# Altium project SLT.PrjPcb (part 2 of 3)

## Sheet USB.SchDoc
size 420 x 297 mm; SheetNumber: 12; SheetTotal: 19
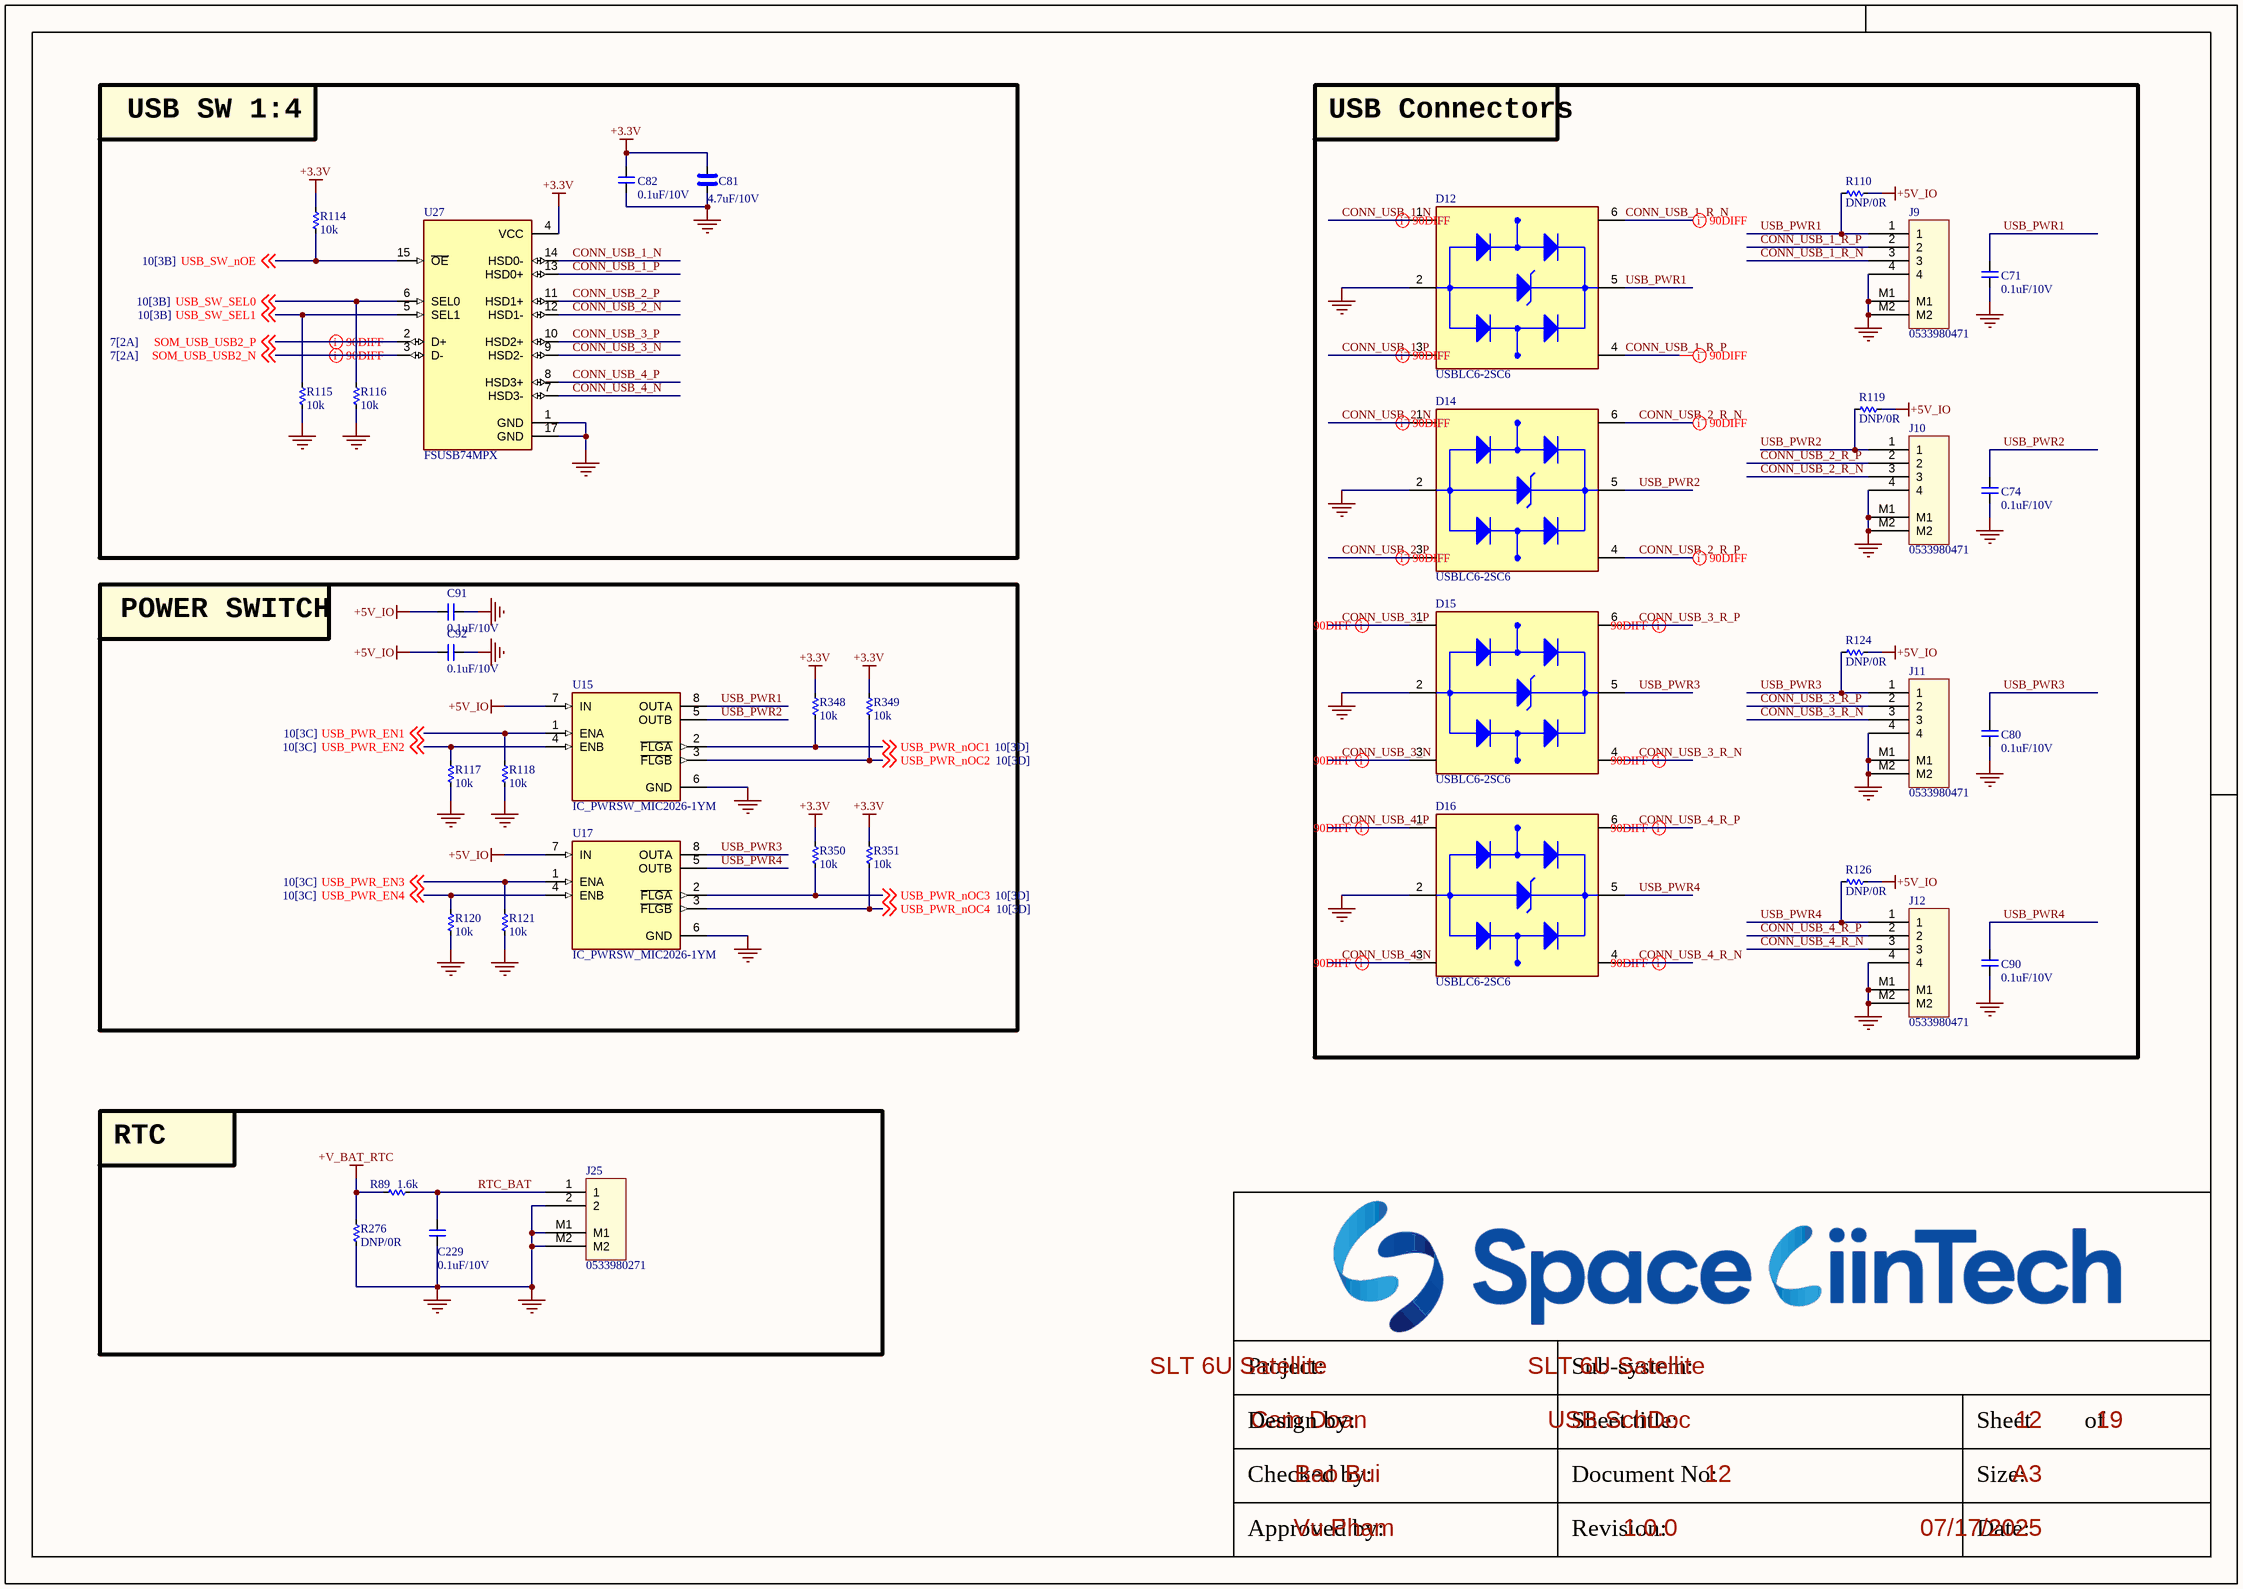
[diagram p18: USB.SchDoc]

### Parts
C71  0.1uF/10V  [CAP_C_1005X60]
C74  0.1uF/10V  [CAP_C_1005X60]
C80  0.1uF/10V  [CAP_C_1005X60]
C81  4.7uF/10V  [CAP_C_1608X80]
C82  0.1uF/10V  [CAP_C_1005X60]
C90  0.1uF/10V  [CAP_C_1005X60]
C91  0.1uF/10V  [CAP_C_1005X60]
C92  0.1uF/10V  [CAP_C_1005X60]
C229  0.1uF/10V  [CAP_C_1005X60]
D12  USBLC6-2SC6  [SOT95P280X145-6N]
D14  USBLC6-2SC6  [SOT95P280X145-6N]
D15  USBLC6-2SC6  [SOT95P280X145-6N]
D16  USBLC6-2SC6  [SOT95P280X145-6N]
J9  0533980471  [MOLEX_0533980471]
J10  0533980471  [MOLEX_0533980471]
J11  0533980471  [MOLEX_0533980471]
J12  0533980471  [MOLEX_0533980471]
J25  0533980271  [MOLEX_0533980271]
R89  1.6k  [RES_C_1005X40]
R110  DNP/0R  [RES_C_1005X40]
R114  10k  [RES_C_1005X40]
R115  10k  [RES_C_1005X40]
R116  10k  [RES_C_1005X40]
R117  10k  [RES_C_1005X40]
R118  10k  [RES_C_1005X40]
R119  DNP/0R  [RES_C_1005X40]
R120  10k  [RES_C_1005X40]
R121  10k  [RES_C_1005X40]
R124  DNP/0R  [RES_C_1005X40]
R126  DNP/0R  [RES_C_1005X40]
R276  DNP/0R  [RES_C_1005X40]
R348  10k  [RES_C_1005X40]
R349  10k  [RES_C_1005X40]
R350  10k  [RES_C_1005X40]
R351  10k  [RES_C_1005X40]
U15  IC_PWRSW_MIC2026-1YM  [SOIC127P602X173-8N]
U17  IC_PWRSW_MIC2026-1YM  [SOIC127P602X173-8N]
U27  FSUSB74MPX  [QFN50P300X300X80-17N]

### Blocks framed on the sheet
USB SW 1:4: C81 C82 R114-R116 U27
USB Connectors: C71 C74 C80 C90 D12 D14-D16 J9-J12 R110 R119 R124 R126
POWER SWITCH: C91 C92 R117 R118 R120 R121 R348-R351 U15 U17
RTC: C229 J25 R89 R276

### Nets
+3.3V: C81.2 C82.2 R114.1 R348.1 R349.1 R350.1 R351.1 U27.4(VCC)
+5V_IO: C91.2 C92.2 R110.1 R119.1 R124.1 R126.1 U15.7(IN) U17.7(IN)  [project net NTC1+]
+V_BAT_RTC: R89.1 R276.1
GND: C71.1 C74.1 C80.1 C81.1 C82.1 C90.1 C91.1 C92.1 C229.1 D12.2(GND) D14.2(GND) D15.2(GND) D16.2(GND) J9.4 J9.M1 J9.M2 J10.4 J10.M1 J10.M2 J11.4 J11.M1 J11.M2 J12.4 J12.M1 J12.M2 J25.2 J25.M1 J25.M2 R115.2 R116.2 R117.2 R118.2 R120.2 R121.2 R276.2 U15.6(GND) U17.6(GND) U27.1(GND) U27.17(GND)
CONN_USB_1_N: D12.1(I/O1_IN) U27.14(HSD0-)
CONN_USB_1_P: D12.3(I/O2_IN) U27.13(HSD0+)
CONN_USB_1_R_N: D12.6(I/O1_OUT) J9.3
CONN_USB_1_R_P: D12.4(I/O2_OUT) J9.2
CONN_USB_2_N: D14.1(I/O1_IN) U27.12(HSD1-)
CONN_USB_2_P: D14.3(I/O2_IN) U27.11(HSD1+)
CONN_USB_2_R_N: D14.6(I/O1_OUT) J10.3
CONN_USB_2_R_P: D14.4(I/O2_OUT) J10.2
CONN_USB_3_N: D15.3(I/O2_IN) U27.9(HSD2-)
CONN_USB_3_P: D15.1(I/O1_IN) U27.10(HSD2+)
CONN_USB_3_R_N: D15.4(I/O2_OUT) J11.3
CONN_USB_3_R_P: D15.6(I/O1_OUT) J11.2
CONN_USB_4_N: D16.3(I/O2_IN) U27.7(HSD3-)
CONN_USB_4_P: D16.1(I/O1_IN) U27.8(HSD3+)
CONN_USB_4_R_N: D16.4(I/O2_OUT) J12.3
CONN_USB_4_R_P: D16.6(I/O1_OUT) J12.2
RTC_BAT: C229.2 J25.1 R89.2
SOM_USB_USB2_N: U27.3(D-) ; off-sheet SOM_USB_USB2_N
SOM_USB_USB2_P: U27.2(D+) ; off-sheet SOM_USB_USB2_P
USB_PWR1: C71.2 D12.5(VBUS) J9.1 R110.2 U15.8(OUTA)
USB_PWR2: C74.2 D14.5(VBUS) J10.1 R119.2 U15.5(OUTB)
USB_PWR3: C80.2 D15.5(VBUS) J11.1 R124.2 U17.8(OUTA)
USB_PWR4: C90.2 D16.5(VBUS) J12.1 R126.2 U17.5(OUTB)
USB_PWR_EN1: R118.1 U15.1(ENA) ; off-sheet USB_PWR_EN1
USB_PWR_EN2: R117.1 U15.4(ENB) ; off-sheet USB_PWR_EN2
USB_PWR_EN3: R121.1 U17.1(ENA) ; off-sheet USB_PWR_EN3
USB_PWR_EN4: R120.1 U17.4(ENB) ; off-sheet USB_PWR_EN4
USB_PWR_nOC1: R348.2 U15.2(~{FLGA}) ; off-sheet USB_PWR_nOC1
USB_PWR_nOC2: R349.2 U15.3(~{FLGB}) ; off-sheet USB_PWR_nOC2
USB_PWR_nOC3: R350.2 U17.2(~{FLGA}) ; off-sheet USB_PWR_nOC3
USB_PWR_nOC4: R351.2 U17.3(~{FLGB}) ; off-sheet USB_PWR_nOC4
USB_SW_nOE: R114.2 U27.15(~{OE}) ; off-sheet USB_SW_nOE
USB_SW_SEL0: R116.1 U27.6(SEL0) ; off-sheet USB_SW_SEL0
USB_SW_SEL1: R115.1 U27.5(SEL1) ; off-sheet USB_SW_SEL1

### Layout directives
differential pair; differential pair class DIFF90: CONN_USB_1_N, CONN_USB_1_P, CONN_USB_1_R_N, CONN_USB_1_R_P, CONN_USB_2_N, CONN_USB_2_P, CONN_USB_2_R_N, CONN_USB_2_R_P, CONN_USB_3_N, CONN_USB_3_P, CONN_USB_3_R_N, CONN_USB_3_R_P, CONN_USB_4_N, CONN_USB_4_P, CONN_USB_4_R_N, CONN_USB_4_R_P, SOM_USB_USB2_N, SOM_USB_USB2_P

### Notes on the sheet
- Project:
- Sub-system:
- Design by:
- Sheet title:
- Sheet
- of
- Checked by:
- Approved by:
- Revision:
- Document No:
- Size:
- Date:
- A3

### Library data of the parts
C71 C74 C80 C82 C90-C92 C229 = _CAP_C_2: CAP CHIP
C81 = _CAP_C_High_2: CAP CHIP High Value
D12 D14-D16 = USBLC6-2SC6: 17V Clamp 5A (8/20Âµs) Ipp Tvs Diode Surface Mount SOT-23-6; MF: STMicroelectronics; Value: *; SnapEDA_Link: https://www.snapeda.com/parts/USBLC6-2SC6/STMicroelectronics/view-part/?ref=snap; Check_prices: https://www.snapeda.com/parts/USBLC6-2SC6/STMicroelectronics/view-part/?ref=eda; Purchase-URL: https://pricing.snapeda.com/search/part/USBLC6-2SC6/?ref=eda; Price: None; Availability: In Stock; Package: SOT-23-6 STMicroelectronics; MP: USBLC6-2SC6
J9-J12 = Header 4x1_2M
J25 = Header 2x1_2M
R89 R110 R114-R121 R124 R126 R276 R348-R351 = _RES_B_2: RES
U15 U17 = IC_PWRSW_MIC2026-1YM: Power Switch/Driver 1:2 N-Channel 1.25A 8-SOIC; MF: Microchip; SnapEDA_Link: https://www.snapeda.com/parts/MIC2026-1YM/Microchip/view-part/?ref=snap; Package: SO-8 Microchip; Value: *; MP: MIC2026-1YM; Check_prices: https://www.snapeda.com/parts/MIC2026-1YM/Microchip/view-part/?ref=eda
U27 = IC_USB_SW_FSUSB74MPX: USB Switch IC 1 Channel 16-MLP (3x3); MF: ON Semiconductor; SnapEDA_Link: https://www.snapeda.com/parts/FSUSB74MPX/Onsemi/view-part/?ref=snap; Package: WQFN-16 ON Semiconductor; Value: *; MP: FSUSB74MPX; Check_prices: https://www.snapeda.com/parts/FSUSB74MPX/Onsemi/view-part/?ref=eda

## Sheet LED.SchDoc
size 420 x 297 mm; SheetNumber: 13; SheetTotal: 19
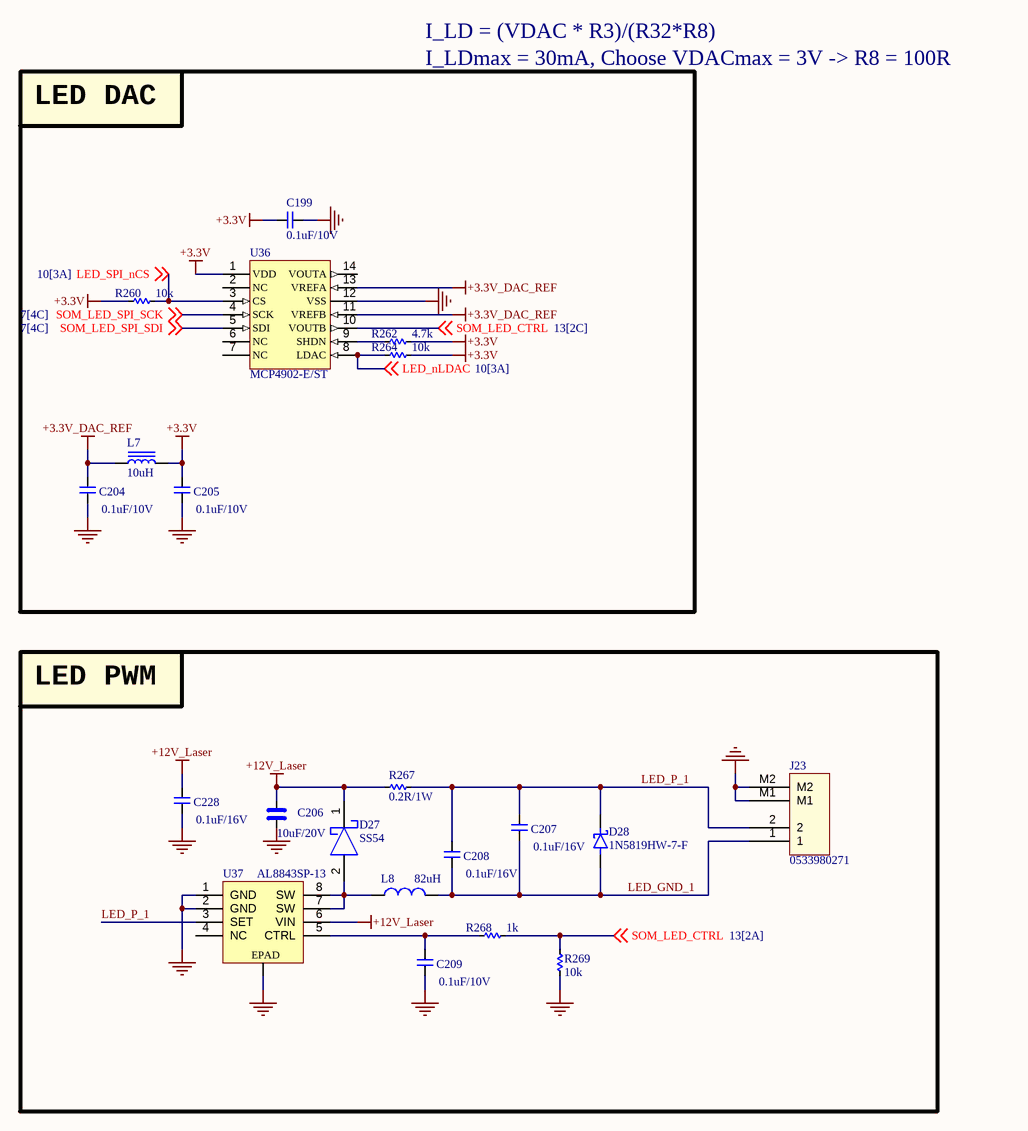
[diagram p19: LED.SchDoc]

### Parts
C199  0.1uF/10V  [CAP_C_1005X60]
C204  0.1uF/10V  [CAP_C_1005X60]
C205  0.1uF/10V  [CAP_C_1005X60]
C206  10uF/20V  [CAP_C_2012X110]
C207  0.1uF/16V  [CAP_C_1005X60]
C208  0.1uF/16V  [CAP_C_1005X60]
C209  0.1uF/10V  [CAP_C_1005X60]
C228  0.1uF/16V  [CAP_C_1005X60]
D27  SS54  [DO-214AC_SMA]
D28  1N5819HW-7-F  [SOD3717X145N]
J23  0533980271  [MOLEX_0533980271]
L7  10uH  [IND_C_2012X65]
L8  82uH  [L-SMD-M-4.8x4.8x2.8mm]
R260  10k  [RES_C_1005X40]
R262  4.7k  [RES_C_1005X40]
R264  10k  [RES_C_1005X40]
R267  0.2R/1W  [RES_C_3216X70]
R268  1k  [RES_C_1005X40]
R269  10k  [RES_C_1005X40]
U36  MCP4902-E/ST  [SOIC127P600X175-14N]
U37  AL8843SP-13  [SOIC127P602X173-8N_EPAD]

### Blocks framed on the sheet
LED DAC: C199 C204 C205 L7 R260 R262 R264 U36
LED PWM: C206-C209 C228 D27 D28 J23 L8 R267-R269 U37

### Nets
+3.3V: C199.2 C205.2 L7.2 R260.1 R262.2 R264.2 U36.1(VDD)
+3.3V_DAC_REF: C204.2 L7.1 U36.11(VREFB) U36.13(VREFA)
+12V_Laser: C206.1 C228.2 D27.1 R267.2 U37.6(VIN)
GND: C199.1 C204.1 C205.1 C206.2 C209.1 C228.1 J23.M1 J23.M2 R269.1 U36.12(VSS) U37.1(GND) U37.2(GND) U37.EPAD
LED_GND_1: C207.1 C208.1 D28.2(A) J23.1 L8.2
LED_nLDAC: R264.1 U36.8(LDAC) ; off-sheet LED_nLDAC
LED_P_1: C207.2 C208.2 D28.1(K) J23.2 R267.1 U37.3(SET)
LED_SPI_nCS: R260.2 U36.3(CS) ; off-sheet LED_SPI_nCS
SOM_LED_CTRL: R268.2 R269.2 U36.10(VOUTB) ; off-sheet SOM_LED_CTRL
SOM_LED_SPI_SCK: U36.4(SCK) ; off-sheet SOM_LED_SPI_SCK  [project net SPI1_SCK]
SOM_LED_SPI_SDI: U36.5(SDI) ; off-sheet SOM_LED_SPI_SDI  [project net SPI1_MOSI]
NetC209_2: C209.2 R268.1 U37.5(CTRL)
NetD27_2: D27.2 L8.1 U37.7(SW) U37.8(SW)
NetR262_1: R262.1 U36.9(SHDN)

Not connected (* = marked no-connect by the designer): U36 2(NC) 6(NC) 7(NC) 14(VOUTA); U37 4(NC)

### Notes on the sheet
- I_LD = (VDAC * R3)/(R32*R8)
- I_LDmax = 30mA, Choose VDACmax = 3V -> R8 = 100R
- Project:
- Sub-system:
- Design by:
- Sheet title:
- Sheet
- of
- Checked by:
- Approved by:
- Revision:
- Document No:
- Size:
- Date:
- A3

### Library data of the parts
C199 C204 C205 C207-C209 C228 = _CAP_C_2: CAP CHIP
C206 = _CAP_C_High_2: CAP CHIP High Value
D27 = SS54: DIODE SCHOTTKY 60V 3A DO214AA
D28 = DIODE SCHOTTKY: DIODE SCHOTTKY 40V 1A SOD123
J23 = Header 2x1_2M
L7 = Inductor: MLZ1608N100LT000; Value: 1.5uH
L8 = L-SMD-1: SRR4828A-820M; partNo: 78477010; Manufacturer: Wurth Elektronik; Inductance: 1.0 μH; ComponentLink1Description: Manufacturer; ComponentLink1URL: http://www.we-online.de; Created by: Baojun Chen; Created Date: Nov.2015; ComponentLink2Description: Datasheet; ComponentLink2URL: http://katalog.we-online.de/pbs/datasheet/78477010.pdf
R260 R262 R264 R267-R269 = _RES_B_2: RES
U36 = MCP4902: IC DAC 8BIT V-OUT 14TSSOP
U37 = AL8843SP-13: IC LED DRIVER RGLTR PWM 3A 8SO

## Sheet TEC.SchDoc
size 420 x 297 mm; SheetNumber: 14; SheetTotal: 19
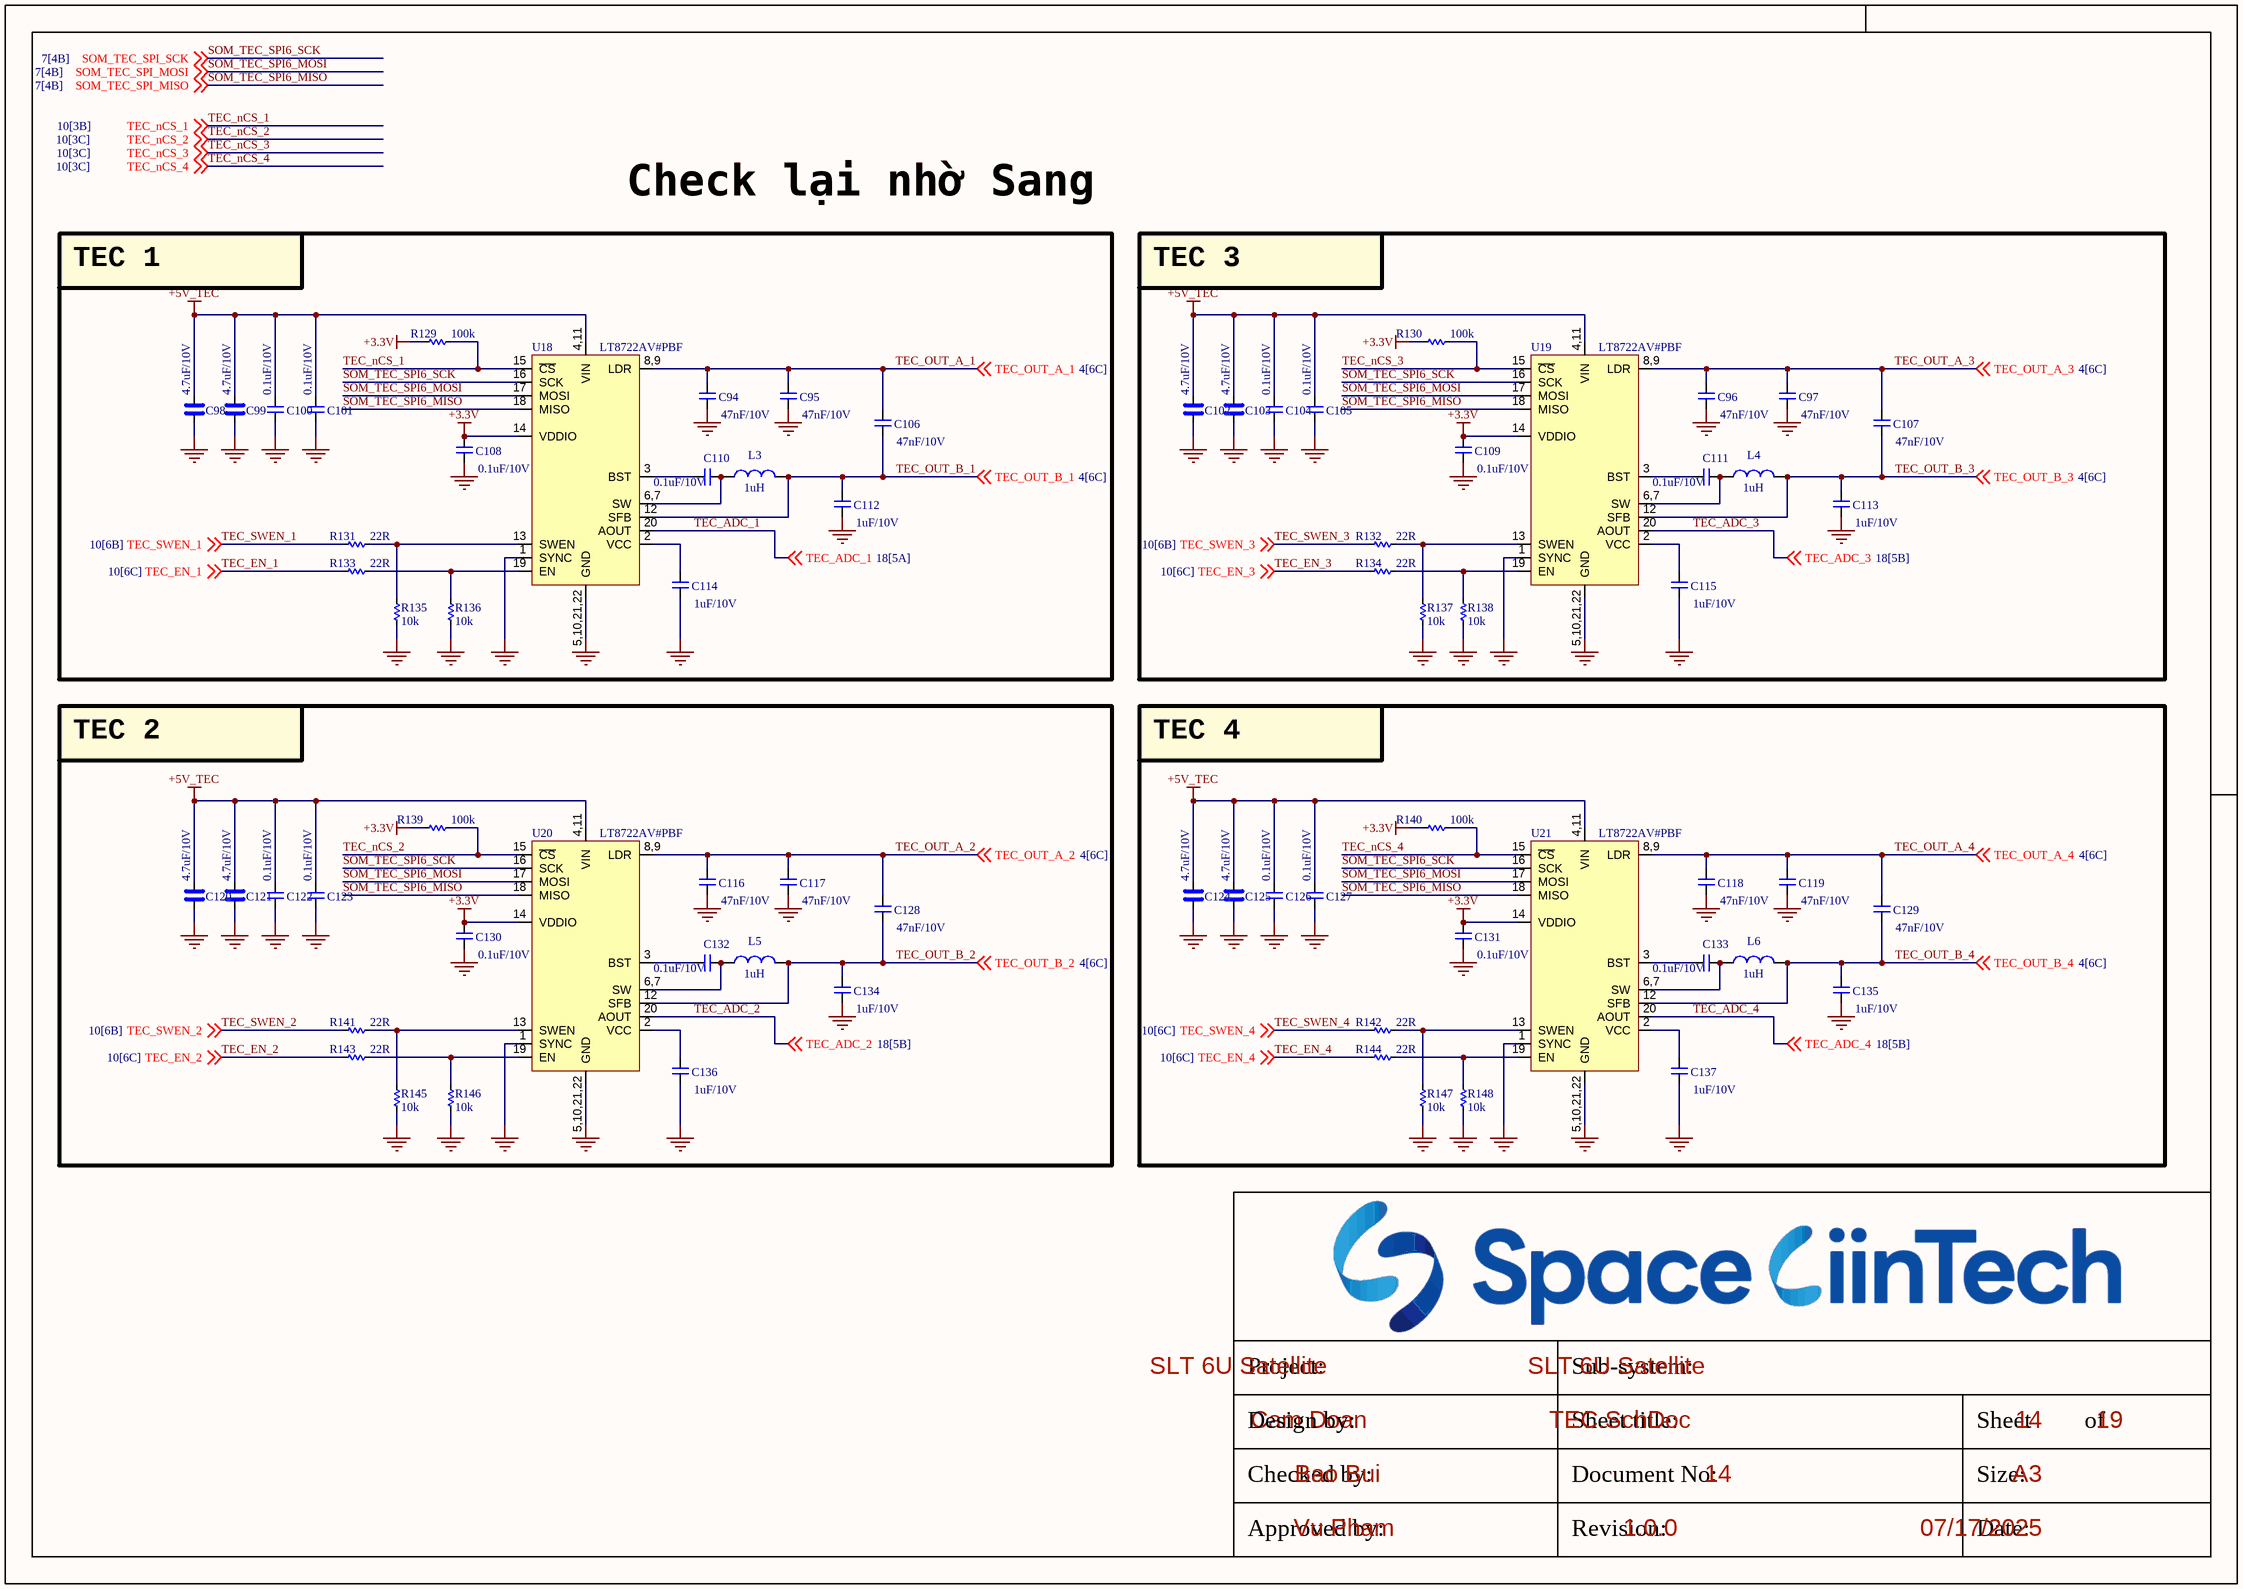
[diagram p20: TEC.SchDoc]

### Parts
C94  47nF/10V  [CAP_C_1005X60]
C95  47nF/10V  [CAP_C_1005X60]
C96  47nF/10V  [CAP_C_1005X60]
C97  47nF/10V  [CAP_C_1005X60]
C98  4.7uF/10V  [CAP_C_1608X80]
C99  4.7uF/10V  [CAP_C_1608X80]
C100  0.1uF/10V  [CAP_C_1005X60]
C101  0.1uF/10V  [CAP_C_1005X60]
C102  4.7uF/10V  [CAP_C_1608X80]
C103  4.7uF/10V  [CAP_C_1608X80]
C104  0.1uF/10V  [CAP_C_1005X60]
C105  0.1uF/10V  [CAP_C_1005X60]
C106  47nF/10V  [CAP_C_1005X60]
C107  47nF/10V  [CAP_C_1005X60]
C108  0.1uF/10V  [CAP_C_1005X60]
C109  0.1uF/10V  [CAP_C_1005X60]
C110  0.1uF/10V  [CAP_C_1005X60]
C111  0.1uF/10V  [CAP_C_1005X60]
C112  1uF/10V  [CAP_C_1005X60]
C113  1uF/10V  [CAP_C_1005X60]
C114  1uF/10V  [CAP_C_1005X60]
C115  1uF/10V  [CAP_C_1005X60]
C116  47nF/10V  [CAP_C_1005X60]
C117  47nF/10V  [CAP_C_1005X60]
C118  47nF/10V  [CAP_C_1005X60]
C119  47nF/10V  [CAP_C_1005X60]
C120  4.7uF/10V  [CAP_C_1608X80]
C121  4.7uF/10V  [CAP_C_1608X80]
C122  0.1uF/10V  [CAP_C_1005X60]
C123  0.1uF/10V  [CAP_C_1005X60]
C124  4.7uF/10V  [CAP_C_1608X80]
C125  4.7uF/10V  [CAP_C_1608X80]
C126  0.1uF/10V  [CAP_C_1005X60]
C127  0.1uF/10V  [CAP_C_1005X60]
C128  47nF/10V  [CAP_C_1005X60]
C129  47nF/10V  [CAP_C_1005X60]
C130  0.1uF/10V  [CAP_C_1005X60]
C131  0.1uF/10V  [CAP_C_1005X60]
C132  0.1uF/10V  [CAP_C_1005X60]
C133  0.1uF/10V  [CAP_C_1005X60]
C134  1uF/10V  [CAP_C_1005X60]
C135  1uF/10V  [CAP_C_1005X60]
C136  1uF/10V  [CAP_C_1005X60]
C137  1uF/10V  [CAP_C_1005X60]
L3  1uH  [L-SMD-M-3.5x3.5x2mm]
L4  1uH  [L-SMD-M-3.5x3.5x2mm]
L5  1uH  [L-SMD-M-3.5x3.5x2mm]
L6  1uH  [L-SMD-M-3.5x3.5x2mm]
R129  100k  [RES_C_1005X40]
R130  100k  [RES_C_1005X40]
R131  22R  [RES_C_1005X40]
R132  22R  [RES_C_1005X40]
R133  22R  [RES_C_1005X40]
R134  22R  [RES_C_1005X40]
R135  10k  [RES_C_1005X40]
R136  10k  [RES_C_1005X40]
R137  10k  [RES_C_1005X40]
R138  10k  [RES_C_1005X40]
R139  100k  [RES_C_1005X40]
R140  100k  [RES_C_1005X40]
R141  22R  [RES_C_1005X40]
R142  22R  [RES_C_1005X40]
R143  22R  [RES_C_1005X40]
R144  22R  [RES_C_1005X40]
R145  10k  [RES_C_1005X40]
R146  10k  [RES_C_1005X40]
R147  10k  [RES_C_1005X40]
R148  10k  [RES_C_1005X40]
U18  LT8722AV#PBF  [QFN18]
U19  LT8722AV#PBF  [QFN18]
U20  LT8722AV#PBF  [QFN18]
U21  LT8722AV#PBF  [QFN18]

### Blocks framed on the sheet
TEC 1: C94 C95 C98-C101 C106 C108 C110 C112 C114 L3 R129 R131 R133 R135 R136 U18
TEC 3: C96 C97 C102-C105 C107 C109 C111 C113 C115 L4 R130 R132 R134 R137 R138 U19
TEC 2: C116 C117 C120-C123 C128 C130 C132 C134 C136 L5 R139 R141 R143 R145 R146 U20
TEC 4: C118 C119 C124-C127 C129 C131 C133 C135 C137 L6 R140 R142 R144 R147 R148 U21

### Nets
+3.3V: C108.2 C109.2 C130.2 C131.2 R129.1 R130.1 R139.1 R140.1 U18.14(VDDIO) U19.14(VDDIO) U20.14(VDDIO) U21.14(VDDIO)
+5V_TEC: C98.2 C99.2 C100.2 C101.2 C102.2 C103.2 C104.2 C105.2 C120.2 C121.2 C122.2 C123.2 C124.2 C125.2 C126.2 C127.2 U18.4,11(VIN) U19.4,11(VIN) U20.4,11(VIN) U21.4,11(VIN)
GND: C94.1 C95.1 C96.1 C97.1 C98.1 C99.1 C100.1 C101.1 C102.1 C103.1 C104.1 C105.1 C108.1 C109.1 C112.1 C113.1 C114.1 C115.1 C116.1 C117.1 C118.1 C119.1 C120.1 C121.1 C122.1 C123.1 C124.1 C125.1 C126.1 C127.1 C130.1 C131.1 C134.1 C135.1 C136.1 C137.1 R135.2 R136.2 R137.2 R138.2 R145.2 R146.2 R147.2 R148.2 U18.1(SYNC) U18.5,10,21,22(GND) U19.1(SYNC) U19.5,10,21,22(GND) U20.1(SYNC) U20.5,10,21,22(GND) U21.1(SYNC) U21.5,10,21,22(GND)
SOM_TEC_SPI6_MISO: U18.18(MISO) U19.18(MISO) U20.18(MISO) U21.18(MISO) ; off-sheet SOM_TEC_SPI_MISO  [also labelled SOM_TEC_SPI_MISO]
SOM_TEC_SPI6_MOSI: U18.17(MOSI) U19.17(MOSI) U20.17(MOSI) U21.17(MOSI) ; off-sheet SOM_TEC_SPI_MOSI  [also labelled SOM_TEC_SPI_MOSI]
SOM_TEC_SPI6_SCK: U18.16(SCK) U19.16(SCK) U20.16(SCK) U21.16(SCK) ; off-sheet SOM_TEC_SPI_SCK  [also labelled SOM_TEC_SPI_SCK]
TEC_ADC_1: U18.20(AOUT) ; off-sheet TEC_ADC_1
TEC_ADC_2: U20.20(AOUT) ; off-sheet TEC_ADC_2
TEC_ADC_3: U19.20(AOUT) ; off-sheet TEC_ADC_3
TEC_ADC_4: U21.20(AOUT) ; off-sheet TEC_ADC_4
TEC_EN_1: R133.2 ; off-sheet TEC_EN_1
TEC_EN_2: R143.2 ; off-sheet TEC_EN_2
TEC_EN_3: R134.2 ; off-sheet TEC_EN_3
TEC_EN_4: R144.2 ; off-sheet TEC_EN_4
TEC_nCS_1: R129.2 U18.15(~{CS}) ; off-sheet TEC_nCS_1
TEC_nCS_2: R139.2 U20.15(~{CS}) ; off-sheet TEC_nCS_2
TEC_nCS_3: R130.2 U19.15(~{CS}) ; off-sheet TEC_nCS_3
TEC_nCS_4: R140.2 U21.15(~{CS}) ; off-sheet TEC_nCS_4
TEC_OUT_A_1: C94.2 C95.2 C106.2 U18.8,9(LDR) ; off-sheet TEC_OUT_A_1
TEC_OUT_A_2: C116.2 C117.2 C128.2 U20.8,9(LDR) ; off-sheet TEC_OUT_A_2
TEC_OUT_A_3: C96.2 C97.2 C107.2 U19.8,9(LDR) ; off-sheet TEC_OUT_A_3
TEC_OUT_A_4: C118.2 C119.2 C129.2 U21.8,9(LDR) ; off-sheet TEC_OUT_A_4
TEC_OUT_B_1: C106.1 C112.2 L3.2 U18.12(SFB) ; off-sheet TEC_OUT_B_1
TEC_OUT_B_2: C128.1 C134.2 L5.2 U20.12(SFB) ; off-sheet TEC_OUT_B_2
TEC_OUT_B_3: C107.1 C113.2 L4.2 U19.12(SFB) ; off-sheet TEC_OUT_B_3
TEC_OUT_B_4: C129.1 C135.2 L6.2 U21.12(SFB) ; off-sheet TEC_OUT_B_4
TEC_SWEN_1: R131.1 ; off-sheet TEC_SWEN_1
TEC_SWEN_2: R141.1 ; off-sheet TEC_SWEN_2
TEC_SWEN_3: R132.1 ; off-sheet TEC_SWEN_3
TEC_SWEN_4: R142.1 ; off-sheet TEC_SWEN_4
NetC110_1: C110.1 L3.1 U18.6,7(SW)
NetC110_2: C110.2 U18.3(BST)
NetC111_1: C111.1 L4.1 U19.6,7(SW)
NetC111_2: C111.2 U19.3(BST)
NetC114_2: C114.2 U18.2(VCC)
NetC115_2: C115.2 U19.2(VCC)
NetC132_1: C132.1 L5.1 U20.6,7(SW)
NetC132_2: C132.2 U20.3(BST)
NetC133_1: C133.1 L6.1 U21.6,7(SW)
NetC133_2: C133.2 U21.3(BST)
NetC136_2: C136.2 U20.2(VCC)
NetC137_2: C137.2 U21.2(VCC)
NetR131_2: R131.2 R135.1 U18.13(SWEN)
NetR132_2: R132.2 R137.1 U19.13(SWEN)
NetR133_1: R133.1 R136.1 U18.19(EN)
NetR134_1: R134.1 R138.1 U19.19(EN)
NetR141_2: R141.2 R145.1 U20.13(SWEN)
NetR142_2: R142.2 R147.1 U21.13(SWEN)
NetR143_1: R143.1 R146.1 U20.19(EN)
NetR144_1: R144.1 R148.1 U21.19(EN)

### Notes on the sheet
- Check lại nhờ Sang
- Project:
- Sub-system:
- Design by:
- Sheet title:
- Sheet
- of
- Checked by:
- Approved by:
- Revision:
- Document No:
- Size:
- Date:
- A3

### Library data of the parts
C94-C97 C100 C101 C104-C119 C122 C123 C126-C137 = _CAP_C_2: CAP CHIP
C98 C99 C102 C103 C120 C121 C124 C125 = _CAP_C_High_2: CAP CHIP High Value
L3-L6 = L-SMD-1: partNo: 78477010; Manufacturer: Wurth Elektronik; Inductance: 1.0 μH; ComponentLink1Description: Manufacturer; ComponentLink1URL: http://www.we-online.de; Created by: Baojun Chen; Created Date: Nov.2015; ComponentLink2Description: Datasheet; ComponentLink2URL: http://katalog.we-online.de/pbs/datasheet/78477010.pdf
R129-R148 = _RES_B_2: RES
U18-U21 = LT8722

## Sheet HEATER.SchDoc
size 420 x 297 mm; SheetNumber: 15; SheetTotal: 19
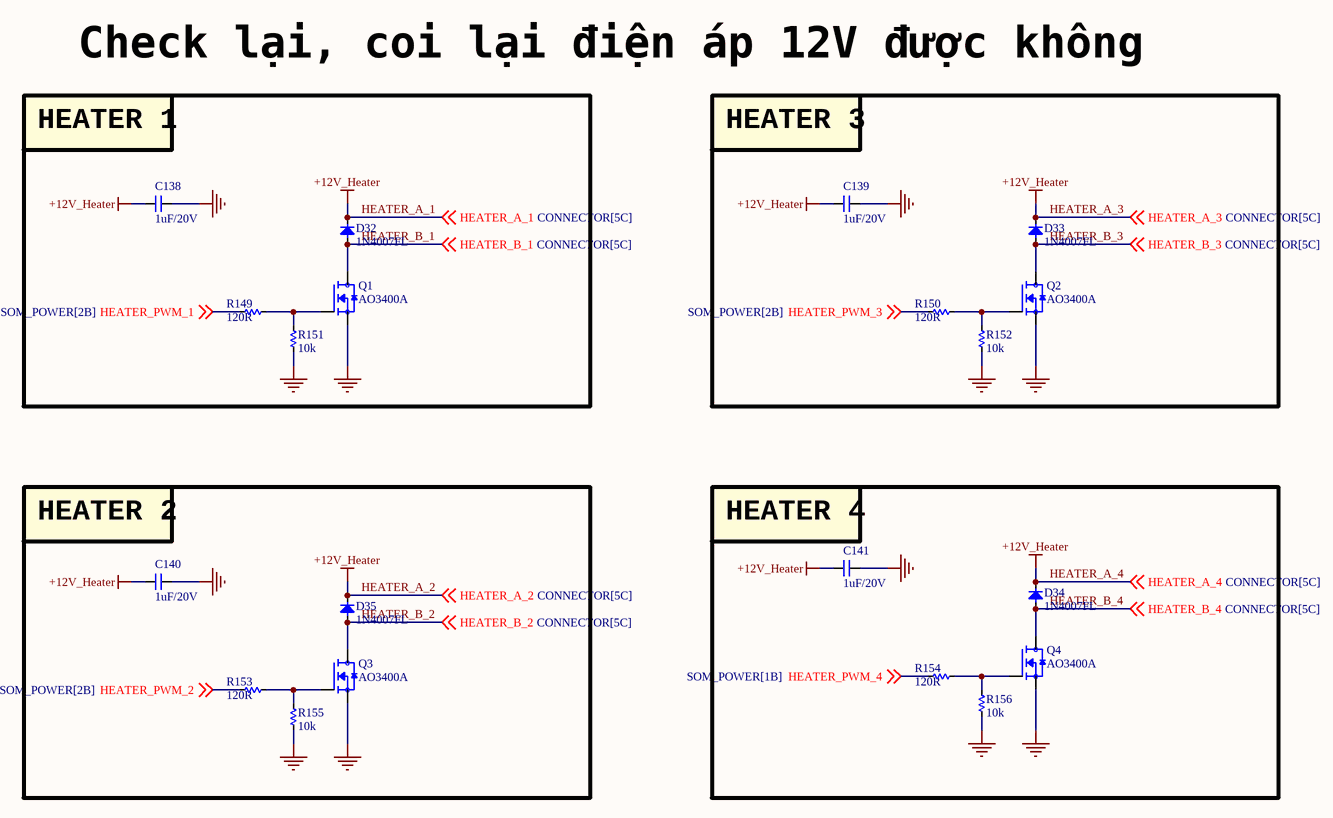
[diagram p21: HEATER.SchDoc]

### Parts
C138  1uF/20V  [CAP_C_1005X60]
C139  1uF/20V  [CAP_C_1005X60]
C140  1uF/20V  [CAP_C_1005X60]
C141  1uF/20V  [CAP_C_1005X60]
D32  1N4007FL  [DIO-SMD-106]
D33  1N4007FL  [DIO-SMD-106]
D34  1N4007FL  [DIO-SMD-106]
D35  1N4007FL  [DIO-SMD-106]
Q1  AO3400A  [SOT95P240X120-3N]
Q2  AO3400A  [SOT95P240X120-3N]
Q3  AO3400A  [SOT95P240X120-3N]
Q4  AO3400A  [SOT95P240X120-3N]
R149  120R  [RES_C_1005X40]
R150  120R  [RES_C_1005X40]
R151  10k  [RES_C_1005X40]
R152  10k  [RES_C_1005X40]
R153  120R  [RES_C_1005X40]
R154  120R  [RES_C_1005X40]
R155  10k  [RES_C_1005X40]
R156  10k  [RES_C_1005X40]

### Blocks framed on the sheet
HEATER 1: C138 D32 Q1 R149 R151
HEATER 3: C139 D33 Q2 R150 R152
HEATER 2: C140 D35 Q3 R153 R155
HEATER 4: C141 D34 Q4 R154 R156

### Nets
GND: C138.1 C139.1 C140.1 C141.1 Q1.2(S) Q2.2(S) Q3.2(S) Q4.2(S) R151.1 R152.1 R155.1 R156.1
HEATER_A_1: C138.2 C139.2 C140.2 C141.2 D32.1(K) D33.1(K) D34.1(K) D35.1(K) ; off-sheet HEATER_A_1, off-sheet HEATER_A_2, off-sheet HEATER_A_3, off-sheet HEATER_A_4  [also labelled +12V_Heater, HEATER_A_2, HEATER_A_3, HEATER_A_4]
HEATER_B_1: D32.2(A) Q1.3(D) ; off-sheet HEATER_B_1
HEATER_B_2: D35.2(A) Q3.3(D) ; off-sheet HEATER_B_2
HEATER_B_3: D33.2(A) Q2.3(D) ; off-sheet HEATER_B_3
HEATER_B_4: D34.2(A) Q4.3(D) ; off-sheet HEATER_B_4
HEATER_PWM_1: R149.1 ; off-sheet HEATER_PWM_1
HEATER_PWM_2: R153.1 ; off-sheet HEATER_PWM_2
HEATER_PWM_3: R150.1 ; off-sheet HEATER_PWM_3
HEATER_PWM_4: R154.1 ; off-sheet HEATER_PWM_4
NetQ1_1: Q1.1(G) R149.2 R151.2
NetQ2_1: Q2.1(G) R150.2 R152.2
NetQ3_1: Q3.1(G) R153.2 R155.2
NetQ4_1: Q4.1(G) R154.2 R156.2

### Notes on the sheet
- Check lại, coi lại điện áp 12V được không
- Project:
- Sub-system:
- Design by:
- Sheet title:
- Sheet
- of
- Checked by:
- Approved by:
- Revision:
- Document No:
- Size:
- Date:
- A3

### Library data of the parts
C138-C141 = _CAP_C_2: CAP CHIP
D32-D35 = Diode SMD: Default Diode; Code - JEDEC: DO-214-AB; Value: 1N5007; Published: 8-Jun-2000; Revision: July-2002: Re-released for DXP Platform.; Publisher: Altium Limited
Q1-Q4 = MOSFET_N: N-Channel 30 V 5.7A (Ta) 1.4W (Ta) Surface Mount SOT-23-3; MF: Alpha & Omega Semiconductor; SnapEDA_Link: https://www.snapeda.com/parts/AO3400A/Alpha/view-part/?ref=snap; Package: SOT-23 Alpha &amp; Omega Semiconductor Inc.; Value: *; MP: AO3400A; Check_prices: https://www.snapeda.com/parts/AO3400A/Alpha/view-part/?ref=eda
R149-R156 = _RES_B_2: RES

## Sheet NTC.SchDoc
size 420 x 297 mm; SheetNumber: 16; SheetTotal: 19
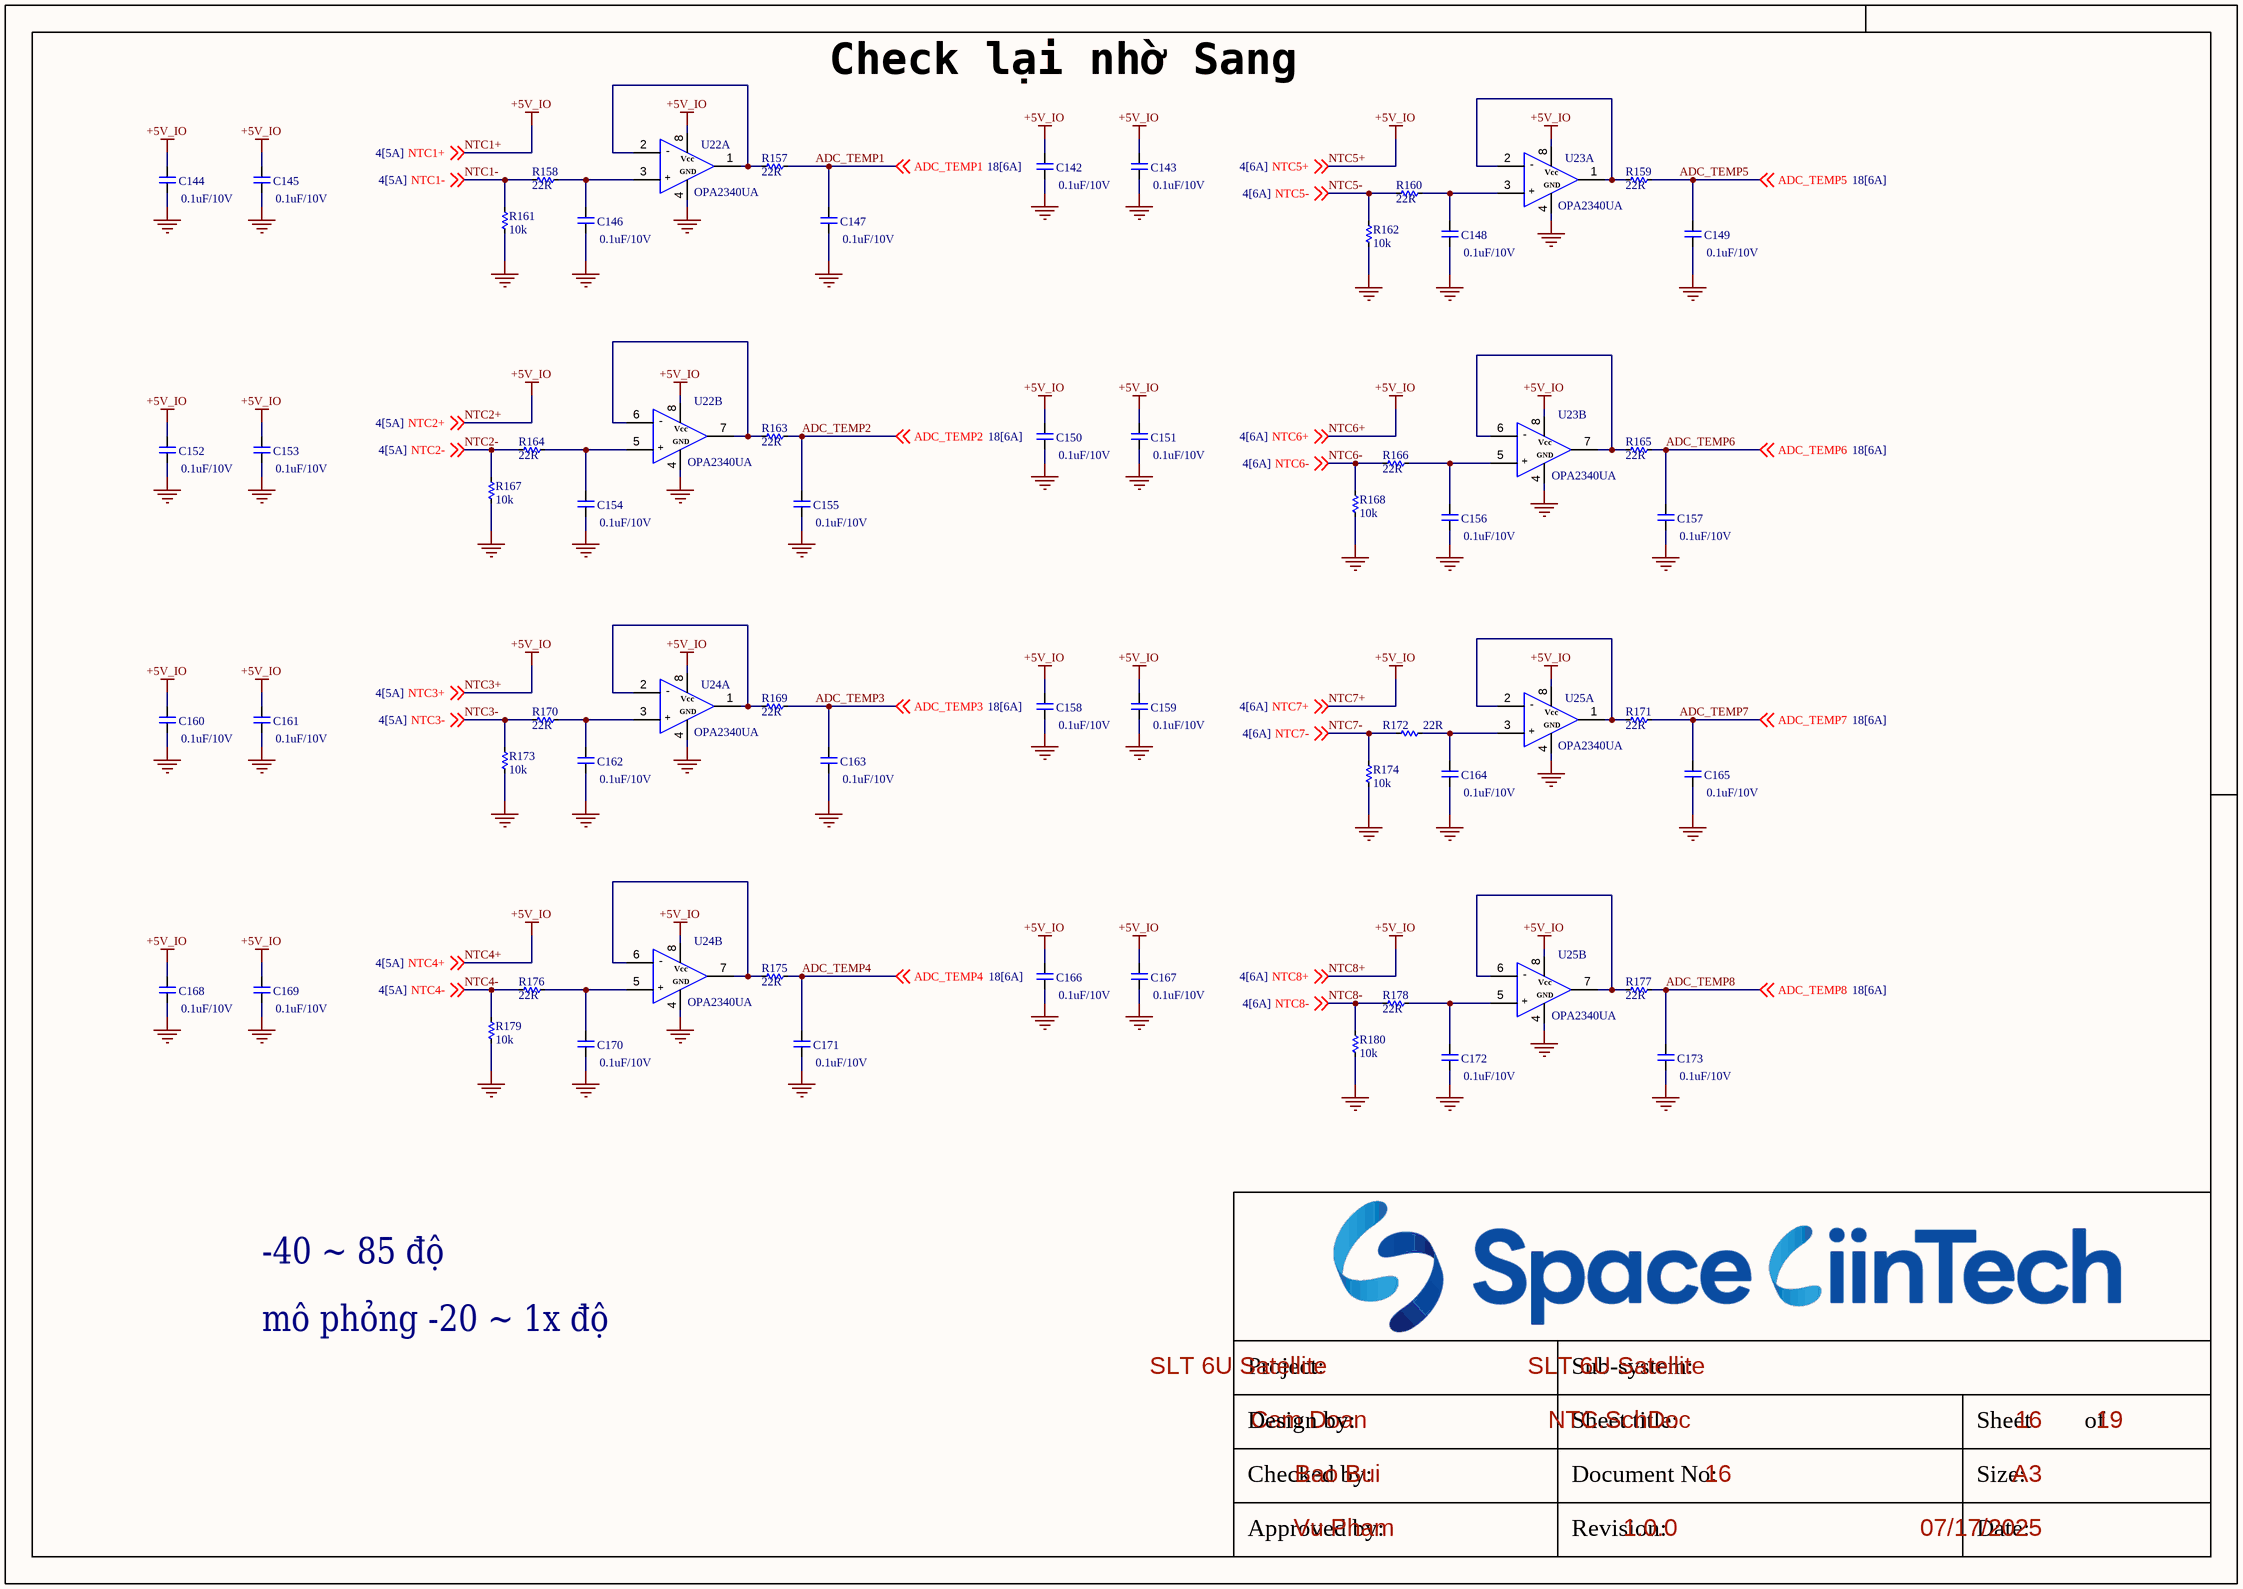
[diagram p22: NTC.SchDoc]

### Parts
C142  0.1uF/10V  [CAP_C_1005X60]
C143  0.1uF/10V  [CAP_C_1005X60]
C144  0.1uF/10V  [CAP_C_1005X60]
C145  0.1uF/10V  [CAP_C_1005X60]
C146  0.1uF/10V  [CAP_C_1005X60]
C147  0.1uF/10V  [CAP_C_1005X60]
C148  0.1uF/10V  [CAP_C_1005X60]
C149  0.1uF/10V  [CAP_C_1005X60]
C150  0.1uF/10V  [CAP_C_1005X60]
C151  0.1uF/10V  [CAP_C_1005X60]
C152  0.1uF/10V  [CAP_C_1005X60]
C153  0.1uF/10V  [CAP_C_1005X60]
C154  0.1uF/10V  [CAP_C_1005X60]
C155  0.1uF/10V  [CAP_C_1005X60]
C156  0.1uF/10V  [CAP_C_1005X60]
C157  0.1uF/10V  [CAP_C_1005X60]
C158  0.1uF/10V  [CAP_C_1005X60]
C159  0.1uF/10V  [CAP_C_1005X60]
C160  0.1uF/10V  [CAP_C_1005X60]
C161  0.1uF/10V  [CAP_C_1005X60]
C162  0.1uF/10V  [CAP_C_1005X60]
C163  0.1uF/10V  [CAP_C_1005X60]
C164  0.1uF/10V  [CAP_C_1005X60]
C165  0.1uF/10V  [CAP_C_1005X60]
C166  0.1uF/10V  [CAP_C_1005X60]
C167  0.1uF/10V  [CAP_C_1005X60]
C168  0.1uF/10V  [CAP_C_1005X60]
C169  0.1uF/10V  [CAP_C_1005X60]
C170  0.1uF/10V  [CAP_C_1005X60]
C171  0.1uF/10V  [CAP_C_1005X60]
C172  0.1uF/10V  [CAP_C_1005X60]
C173  0.1uF/10V  [CAP_C_1005X60]
R157  22R  [RES_C_1005X40]
R158  22R  [RES_C_1005X40]
R159  22R  [RES_C_1005X40]
R160  22R  [RES_C_1005X40]
R161  10k  [RES_C_1005X40]
R162  10k  [RES_C_1005X40]
R163  22R  [RES_C_1005X40]
R164  22R  [RES_C_1005X40]
R165  22R  [RES_C_1005X40]
R166  22R  [RES_C_1005X40]
R167  10k  [RES_C_1005X40]
R168  10k  [RES_C_1005X40]
R169  22R  [RES_C_1005X40]
R170  22R  [RES_C_1005X40]
R171  22R  [RES_C_1005X40]
R172  22R  [RES_C_1005X40]
R173  10k  [RES_C_1005X40]
R174  10k  [RES_C_1005X40]
R175  22R  [RES_C_1005X40]
R176  22R  [RES_C_1005X40]
R177  22R  [RES_C_1005X40]
R178  22R  [RES_C_1005X40]
R179  10k  [RES_C_1005X40]
R180  10k  [RES_C_1005X40]
U22  OPA2340UA  [SOIC127P602X173-8N]  (parts A,B of 2)
U23  OPA2340UA  [SOIC127P602X173-8N]  (parts A,B of 2)
U24  OPA2340UA  [SOIC127P602X173-8N]  (parts A,B of 2)
U25  OPA2340UA  [SOIC127P602X173-8N]  (parts A,B of 2)

### Nets
GND: C142.1 C143.1 C144.1 C145.1 C146.1 C147.1 C148.1 C149.1 C150.1 C151.1 C152.1 C153.1 C154.1 C155.1 C156.1 C157.1 C158.1 C159.1 C160.1 C161.1 C162.1 C163.1 C164.1 C165.1 C166.1 C167.1 C168.1 C169.1 C170.1 C171.1 C172.1 C173.1 R161.1 R162.1 R167.1 R168.1 R173.1 R174.1 R179.1 R180.1 U22.4 U23.4 U24.4 U25.4
NTC1+: C142.2 C143.2 C144.2 C145.2 C150.2 C151.2 C152.2 C153.2 C158.2 C159.2 C160.2 C161.2 C166.2 C167.2 C168.2 C169.2 U22.8 U23.8 U24.8 U25.8 ; off-sheet NTC1+, off-sheet NTC2+, off-sheet NTC3+, off-sheet NTC4+, off-sheet NTC5+, off-sheet NTC6+, off-sheet NTC7+, off-sheet NTC8+  [also labelled +5V_IO, NTC2+, NTC3+, NTC4+, NTC5+, NTC6+, NTC7+, NTC8+]
ADC_TEMP1: C147.2 R157.2 ; off-sheet ADC_TEMP1
ADC_TEMP2: C155.2 R163.2 ; off-sheet ADC_TEMP2
ADC_TEMP3: C163.2 R169.2 ; off-sheet ADC_TEMP3
ADC_TEMP4: C171.2 R175.2 ; off-sheet ADC_TEMP4
ADC_TEMP5: C149.2 R159.2 ; off-sheet ADC_TEMP5
ADC_TEMP6: C157.2 R165.2 ; off-sheet ADC_TEMP6
ADC_TEMP7: C165.2 R171.2 ; off-sheet ADC_TEMP7
ADC_TEMP8: C173.2 R177.2 ; off-sheet ADC_TEMP8
NTC1-: R158.1 R161.2 ; off-sheet NTC1-
NTC2-: R164.1 R167.2 ; off-sheet NTC2-
NTC3-: R170.1 R173.2 ; off-sheet NTC3-
NTC4-: R176.1 R179.2 ; off-sheet NTC4-
NTC5-: R160.1 R162.2 ; off-sheet NTC5-
NTC6-: R166.1 R168.2 ; off-sheet NTC6-
NTC7-: R172.1 R174.2 ; off-sheet NTC7-
NTC8-: R178.1 R180.2 ; off-sheet NTC8-
NetC146_2: C146.2 R158.2 U22.3
NetC148_2: C148.2 R160.2 U23.3
NetC154_2: C154.2 R164.2 U22.5
NetC156_2: C156.2 R166.2 U23.5
NetC162_2: C162.2 R170.2 U24.3
NetC164_2: C164.2 R172.2 U25.3
NetC170_2: C170.2 R176.2 U24.5
NetC172_2: C172.2 R178.2 U25.5
NetR157_1: R157.1 U22.1 U22.2
NetR159_1: R159.1 U23.1 U23.2
NetR163_1: R163.1 U22.6 U22.7
NetR165_1: R165.1 U23.6 U23.7
NetR169_1: R169.1 U24.1 U24.2
NetR171_1: R171.1 U25.1 U25.2
NetR175_1: R175.1 U24.6 U24.7
NetR177_1: R177.1 U25.6 U25.7

### Notes on the sheet
- Check lại nhờ Sang
- -40 ~ 85 độ
- mô phỏng -20 ~ 1x độ
- Project:
- Sub-system:
- Design by:
- Sheet title:
- Sheet
- of
- Checked by:
- Approved by:
- Revision:
- Document No:
- Size:
- Date:
- A3
- (in symbol OPA2340UA, part A) -; Vcc; GND; +
- (in symbol OPA2340UA, part B) -; Vcc; GND; +

### Library data of the parts
C142-C173 = _CAP_C_2: CAP CHIP
R157-R180 = _RES_B_2: RES

## Sheet FLUIDIC_CTRL.SchDoc
size 420 x 297 mm; SheetNumber: 17; SheetTotal: 19
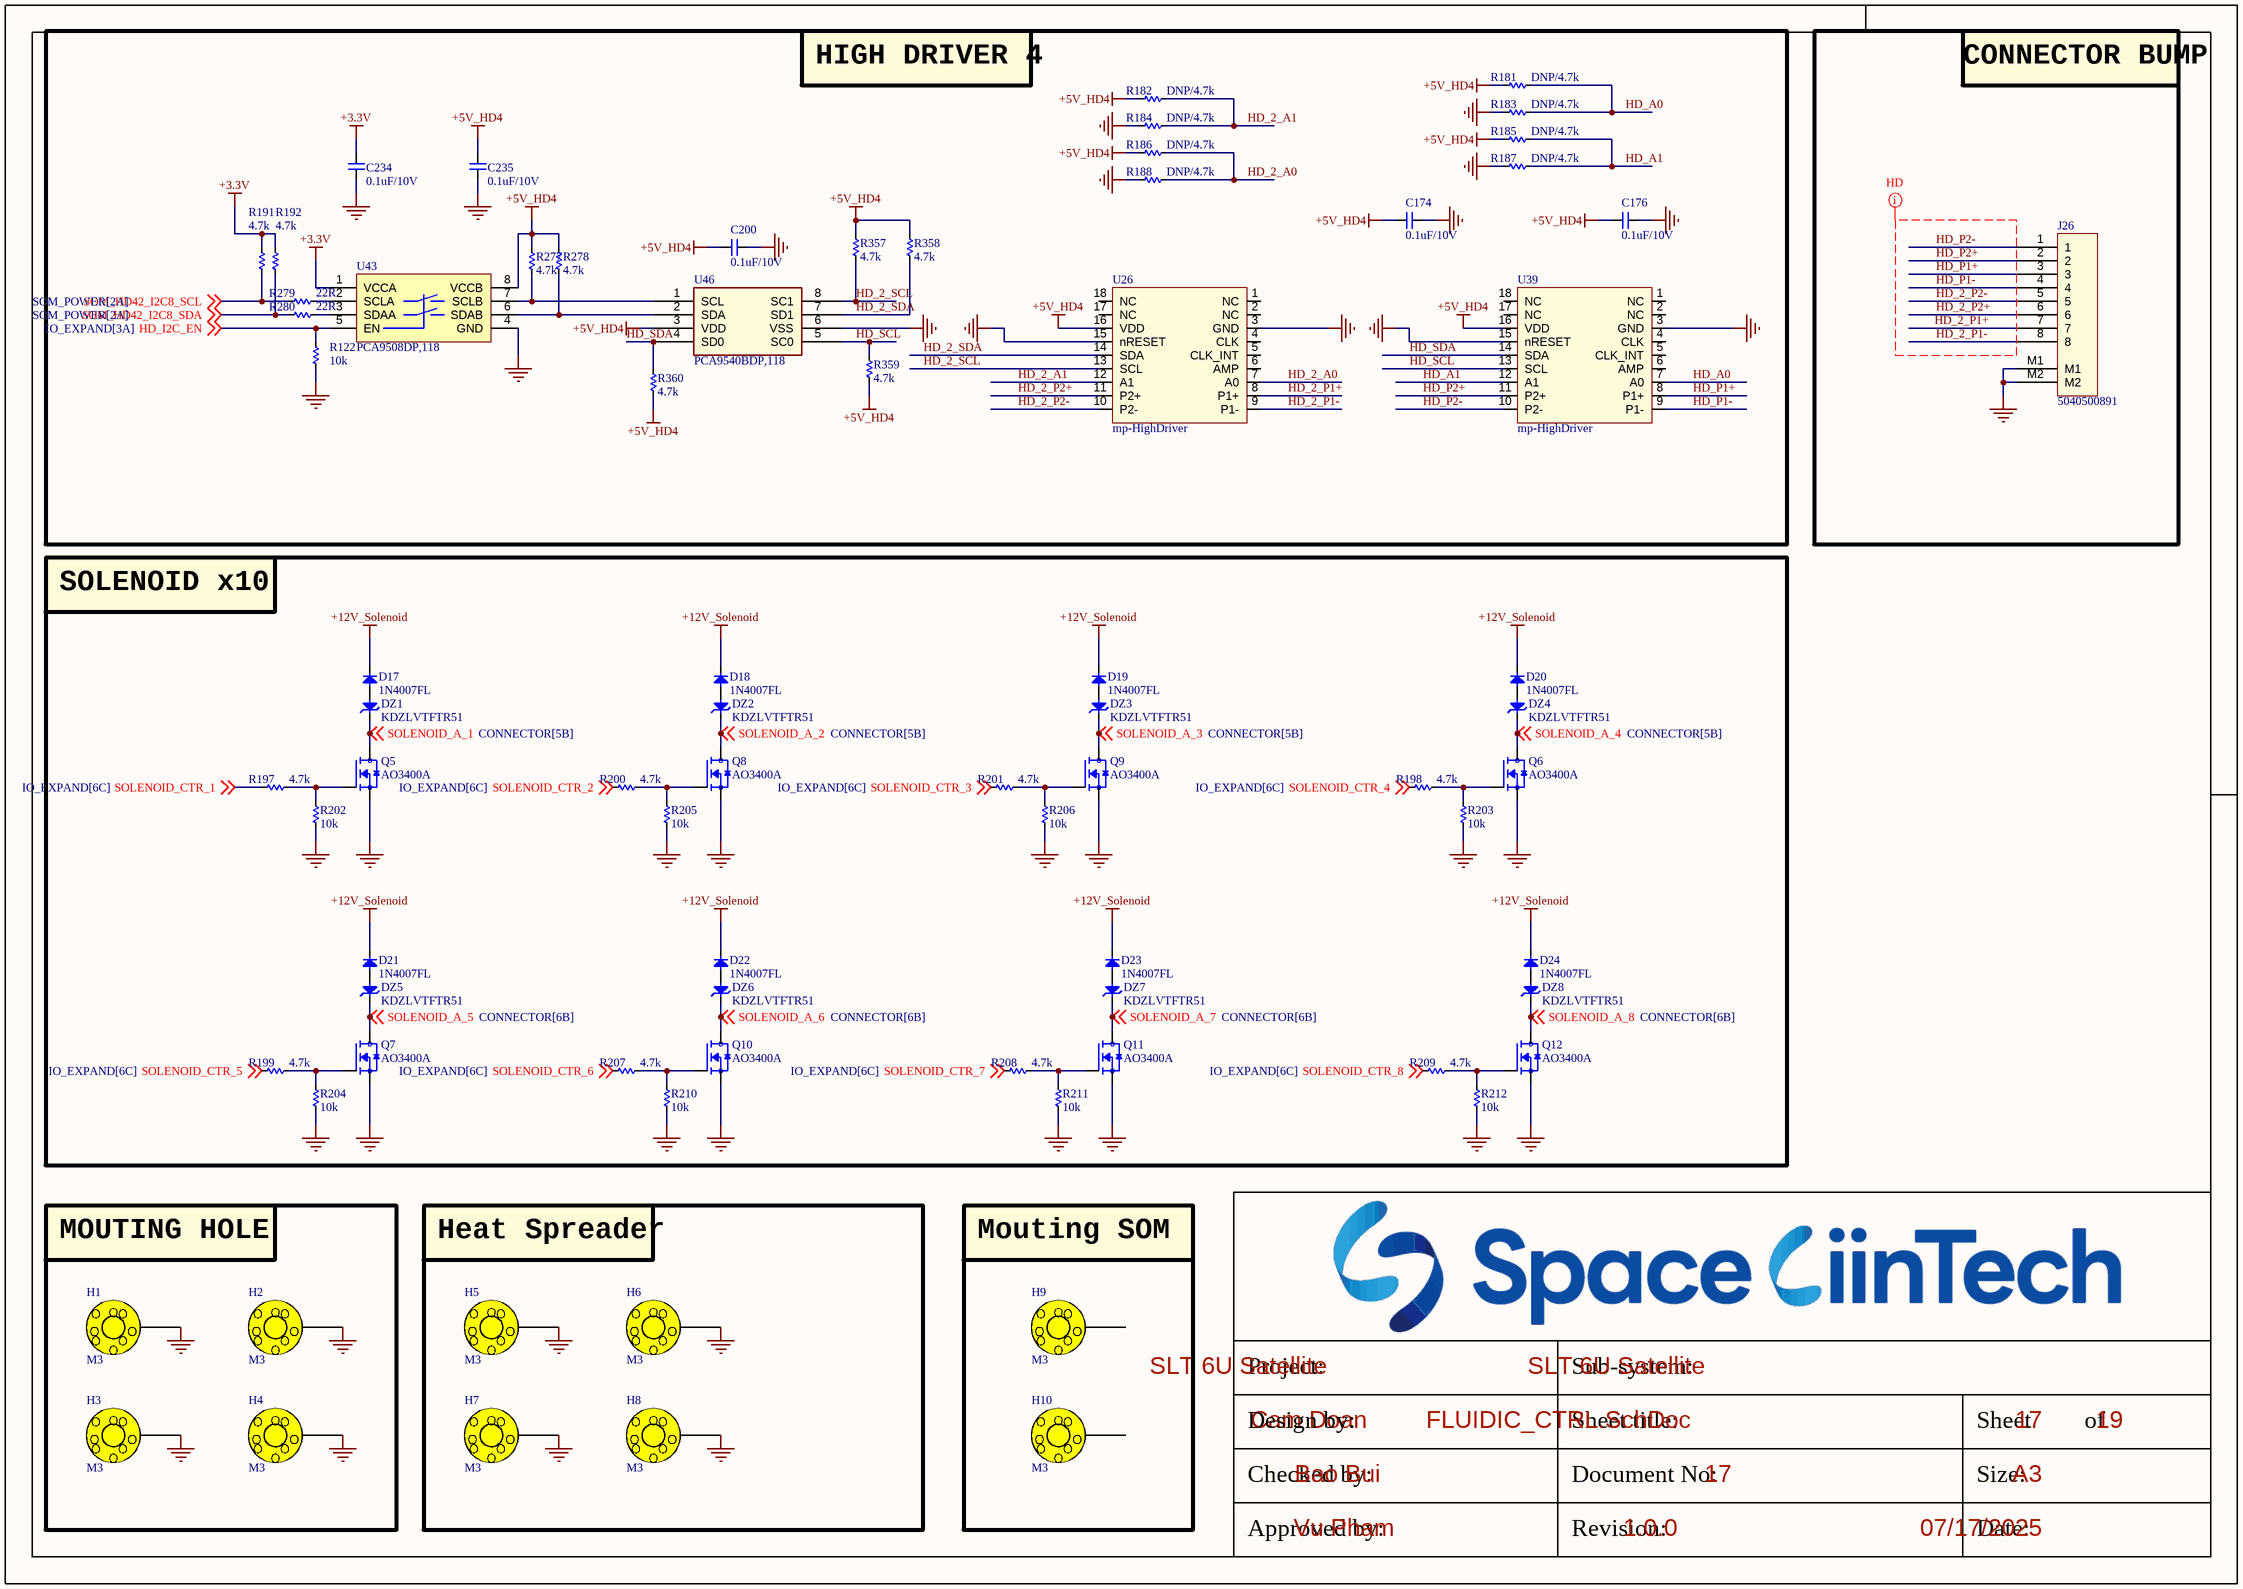
[diagram p23: FLUIDIC_CTRL.SchDoc]

### Parts
C174  0.1uF/10V  [CAP_C_1005X60]
C176  0.1uF/10V  [CAP_C_1005X60]
C200  0.1uF/10V  [CAP_C_1005X60]
C234  0.1uF/10V  [CAP_C_1005X60]
C235  0.1uF/10V  [CAP_C_1005X60]
D17  1N4007FL  [DIO-SMD-106]
D18  1N4007FL  [DIO-SMD-106]
D19  1N4007FL  [DIO-SMD-106]
D20  1N4007FL  [DIO-SMD-106]
D21  1N4007FL  [DIO-SMD-106]
D22  1N4007FL  [DIO-SMD-106]
D23  1N4007FL  [DIO-SMD-106]
D24  1N4007FL  [DIO-SMD-106]
DZ1  KDZLVTFTR51  [DIO-0.5A-SMALL]
DZ2  KDZLVTFTR51  [DIO-0.5A-SMALL]
DZ3  KDZLVTFTR51  [DIO-0.5A-SMALL]
DZ4  KDZLVTFTR51  [DIO-0.5A-SMALL]
DZ5  KDZLVTFTR51  [DIO-0.5A-SMALL]
DZ6  KDZLVTFTR51  [DIO-0.5A-SMALL]
DZ7  KDZLVTFTR51  [DIO-0.5A-SMALL]
DZ8  KDZLVTFTR51  [DIO-0.5A-SMALL]
H1  M3  [HEX-M3]
H2  M3  [HEX-M3]
H3  M3  [HEX-M3]
H4  M3  [HEX-M3]
H5  M3  [HEX-M3]
H6  M3  [HEX-M3]
H7  M3  [HEX-M3]
H8  M3  [HEX-M3]
H9  M3  [Testpoint_TH_D400H200]
H10  M3  [Testpoint_TH_D400H200]
J26  5040500891  [MOLEX_5040500891]
Q5  AO3400A  [SOT95P240X120-3N]
Q6  AO3400A  [SOT95P240X120-3N]
Q7  AO3400A  [SOT95P240X120-3N]
Q8  AO3400A  [SOT95P240X120-3N]
Q9  AO3400A  [SOT95P240X120-3N]
Q10  AO3400A  [SOT95P240X120-3N]
Q11  AO3400A  [SOT95P240X120-3N]
Q12  AO3400A  [SOT95P240X120-3N]
R122  10k  [RES_C_1005X40]
R181  DNP/4.7k  [RES_C_1005X40]
R182  DNP/4.7k  [RES_C_1005X40]
R183  DNP/4.7k  [RES_C_1005X40]
R184  DNP/4.7k  [RES_C_1005X40]
R185  DNP/4.7k  [RES_C_1005X40]
R186  DNP/4.7k  [RES_C_1005X40]
R187  DNP/4.7k  [RES_C_1005X40]
R188  DNP/4.7k  [RES_C_1005X40]
R191  4.7k  [RES_C_1005X40]
R192  4.7k  [RES_C_1005X40]
R197  4.7k  [RES_C_1005X40]
R198  4.7k  [RES_C_1005X40]
R199  4.7k  [RES_C_1005X40]
R200  4.7k  [RES_C_1005X40]
R201  4.7k  [RES_C_1005X40]
R202  10k  [RES_C_1005X40]
R203  10k  [RES_C_1005X40]
R204  10k  [RES_C_1005X40]
R205  10k  [RES_C_1005X40]
R206  10k  [RES_C_1005X40]
R207  4.7k  [RES_C_1005X40]
R208  4.7k  [RES_C_1005X40]
R209  4.7k  [RES_C_1005X40]
R210  10k  [RES_C_1005X40]
R211  10k  [RES_C_1005X40]
R212  10k  [RES_C_1005X40]
R277  4.7k  [RES_C_1005X40]
R278  4.7k  [RES_C_1005X40]
R279  22R  [RES_C_1005X40]
R280  22R  [RES_C_1005X40]
R357  4.7k  [RES_C_1005X40]
R358  4.7k  [RES_C_1005X40]
R359  4.7k  [RES_C_1005X40]
R360  4.7k  [RES_C_1005X40]
U26  mp-HighDriver  [MP_HIGHDRIVER]
U39  mp-HighDriver  [MP_HIGHDRIVER]
U43  PCA9508DP,118  [TSOP8]
U46  PCA9540BDP,118  [SOP65P510X110X300W-8]

### Blocks framed on the sheet
HIGH DRIVER 4: C174 C176 C200 C234 C235 R122 R181-R188 R191 R192 R277-R280 R357-R360 U26 U39 U43 U46
CONNECTOR BUMP: J26
SOLENOID x10: D17-D24 DZ1-DZ8 Q5-Q12 R197-R212
MOUTING HOLE: H1-H4
Heat Spreader: H5-H8
Mouting SOM: H9 H10

### Nets
+3.3V: C234.2 R191.1 R192.1 U43.1(VCCA)
+5V_HD4: C174.2 C176.2 C200.2 C235.2 R181.1 R182.1 R185.1 R186.1 R277.1 R278.1 R357.1 R358.1 R359.1 R360.1 U26.16(VDD) U39.16(VDD) U43.8(VCCB) U46.3(VDD)
+12V_Solenoid: D17.1(K) D18.1(K) D19.1(K) D20.1(K) D21.1(K) D22.1(K) D23.1(K) D24.1(K)
GND: C174.1 C176.1 C200.1 C234.1 C235.1 H1.1 H2.1 H3.1 H4.1 H5.1 H6.1 H7.1 H8.1 J26.M1 J26.M2 Q5.2(S) Q6.2(S) Q7.2(S) Q8.2(S) Q9.2(S) Q10.2(S) Q11.2(S) Q12.2(S) R122.2 R183.1 R184.1 R187.1 R188.1 R202.1 R203.1 R204.1 R205.1 R206.1 R210.1 R211.1 R212.1 U26.3(GND) U26.15(nRESET) U39.3(GND) U39.15(nRESET) U43.4(GND) U46.6(VSS)
HD_2_A0: R186.2 R188.2 U26.7(A0)
HD_2_A1: R182.2 R184.2 U26.12(A1)
HD_2_P1+: J26.7 U26.8(P1+)
HD_2_P1-: J26.8 U26.9(P1-)
HD_2_P2+: J26.6 U26.11(P2+)
HD_2_P2-: J26.5 U26.10(P2-)
HD_2_SCL: R357.2 U26.13(SCL) U46.8(SC1)
HD_2_SDA: R358.2 U26.14(SDA) U46.7(SD1)
HD_A0: R181.2 R183.2 U39.7(A0)
HD_A1: R185.2 R187.2 U39.12(A1)
HD_I2C_EN: R122.1 U43.5(EN) ; off-sheet HD_I2C_EN
HD_P1+: J26.3 U39.8(P1+)
HD_P1-: J26.4 U39.9(P1-)
HD_P2+: J26.2 U39.11(P2+)
HD_P2-: J26.1 U39.10(P2-)
HD_SCL: R359.2 U39.13(SCL) U46.5(SC0)
HD_SDA: R360.2 U39.14(SDA) U46.4(SD0)
SOLENOID_A_1: DZ1.1(K) Q5.3(D) ; off-sheet SOLENOID_A_1
SOLENOID_A_2: DZ2.1(K) Q8.3(D) ; off-sheet SOLENOID_A_2
SOLENOID_A_3: DZ3.1(K) Q9.3(D) ; off-sheet SOLENOID_A_3
SOLENOID_A_4: DZ4.1(K) Q6.3(D) ; off-sheet SOLENOID_A_4
SOLENOID_A_5: DZ5.1(K) Q7.3(D) ; off-sheet SOLENOID_A_5
SOLENOID_A_6: DZ6.1(K) Q10.3(D) ; off-sheet SOLENOID_A_6
SOLENOID_A_7: DZ7.1(K) Q11.3(D) ; off-sheet SOLENOID_A_7
SOLENOID_A_8: DZ8.1(K) Q12.3(D) ; off-sheet SOLENOID_A_8
SOLENOID_CTR_1: R197.2 ; off-sheet SOLENOID_CTR_1
SOLENOID_CTR_2: R200.2 ; off-sheet SOLENOID_CTR_2
SOLENOID_CTR_3: R201.2 ; off-sheet SOLENOID_CTR_3
SOLENOID_CTR_4: R198.2 ; off-sheet SOLENOID_CTR_4
SOLENOID_CTR_5: R199.2 ; off-sheet SOLENOID_CTR_5
SOLENOID_CTR_6: R207.2 ; off-sheet SOLENOID_CTR_6
SOLENOID_CTR_7: R208.2 ; off-sheet SOLENOID_CTR_7
SOLENOID_CTR_8: R209.2 ; off-sheet SOLENOID_CTR_8
SOM_HD42_I2C8_SCL: R191.2 R279.2 ; off-sheet SOM_HD42_I2C8_SCL
SOM_HD42_I2C8_SDA: R192.2 R280.2 ; off-sheet SOM_HD42_I2C8_SDA
NetD17_2: D17.2(A) DZ1.2(A)
NetD18_2: D18.2(A) DZ2.2(A)
NetD19_2: D19.2(A) DZ3.2(A)
NetD20_2: D20.2(A) DZ4.2(A)
NetD21_2: D21.2(A) DZ5.2(A)
NetD22_2: D22.2(A) DZ6.2(A)
NetD23_2: D23.2(A) DZ7.2(A)
NetD24_2: D24.2(A) DZ8.2(A)
NetQ5_1: Q5.1(G) R197.1 R202.2
NetQ6_1: Q6.1(G) R198.1 R203.2
NetQ7_1: Q7.1(G) R199.1 R204.2
NetQ8_1: Q8.1(G) R200.1 R205.2
NetQ9_1: Q9.1(G) R201.1 R206.2
NetQ10_1: Q10.1(G) R207.1 R210.2
NetQ11_1: Q11.1(G) R208.1 R211.2
NetQ12_1: Q12.1(G) R209.1 R212.2
NetR277_2: R277.2 U43.7(SCLB) U46.1(SCL)
NetR278_2: R278.2 U43.6(SDAB) U46.2(SDA)
NetR279_1: R279.1 U43.2(SCLA)
NetR280_1: R280.1 U43.3(SDAA)

Not connected (* = marked no-connect by the designer): H9 1; H10 1; U26 1(NC) 2(NC) 4(CLK) 5(CLK_INT) 6(AMP) 17(NC) 18(NC); U39 1(NC) 2(NC) 4(CLK) 5(CLK_INT) 6(AMP) 17(NC) 18(NC)

### Layout directives
net class HD: HD_2_P1+, HD_2_P1-, HD_2_P2+, HD_2_P2-, HD_P1+, HD_P1-, HD_P2+, HD_P2-

### Notes on the sheet
- Project:
- Sub-system:
- Design by:
- Sheet title:
- Sheet
- of
- Checked by:
- Approved by:
- Revision:
- Document No:
- Size:
- Date:
- A3

### Library data of the parts
C174 C176 C200 C234 C235 = _CAP_C_2: CAP CHIP
D17-D24 = Diode SMD: as D32 on sheet HEATER; Published: 8-Jun-2000; Revision: July-2002: Re-released for DXP Platform.; Publisher: Altium Limited
DZ1-DZ8 = DIODE Zener: Zenner
H1-H10 = HEX-M3
J26 = Header 8x1_2M
Q5-Q12 = MOSFET_N: as Q1 on sheet HEATER; SnapEDA_Link: https://www.snapeda.com/parts/AO3400A/Alpha/view-part/?ref=snap; Package: SOT-23 Alpha &amp; Omega Semiconductor Inc.; Value: *; MP: AO3400A; Check_prices: https://www.snapeda.com/parts/AO3400A/Alpha/view-part/?ref=eda
R122 R181-R188 R191 R192 R197-R212 R277-R280 R357-R360 = _RES_B_2: RES
U46 = IC_I2C_Mux_PCA9540BDP,118: IC INTERFACE SPECIALIZED

## Sheet ADC.SchDoc
size 420 x 297 mm; SheetNumber: 18; SheetTotal: 19
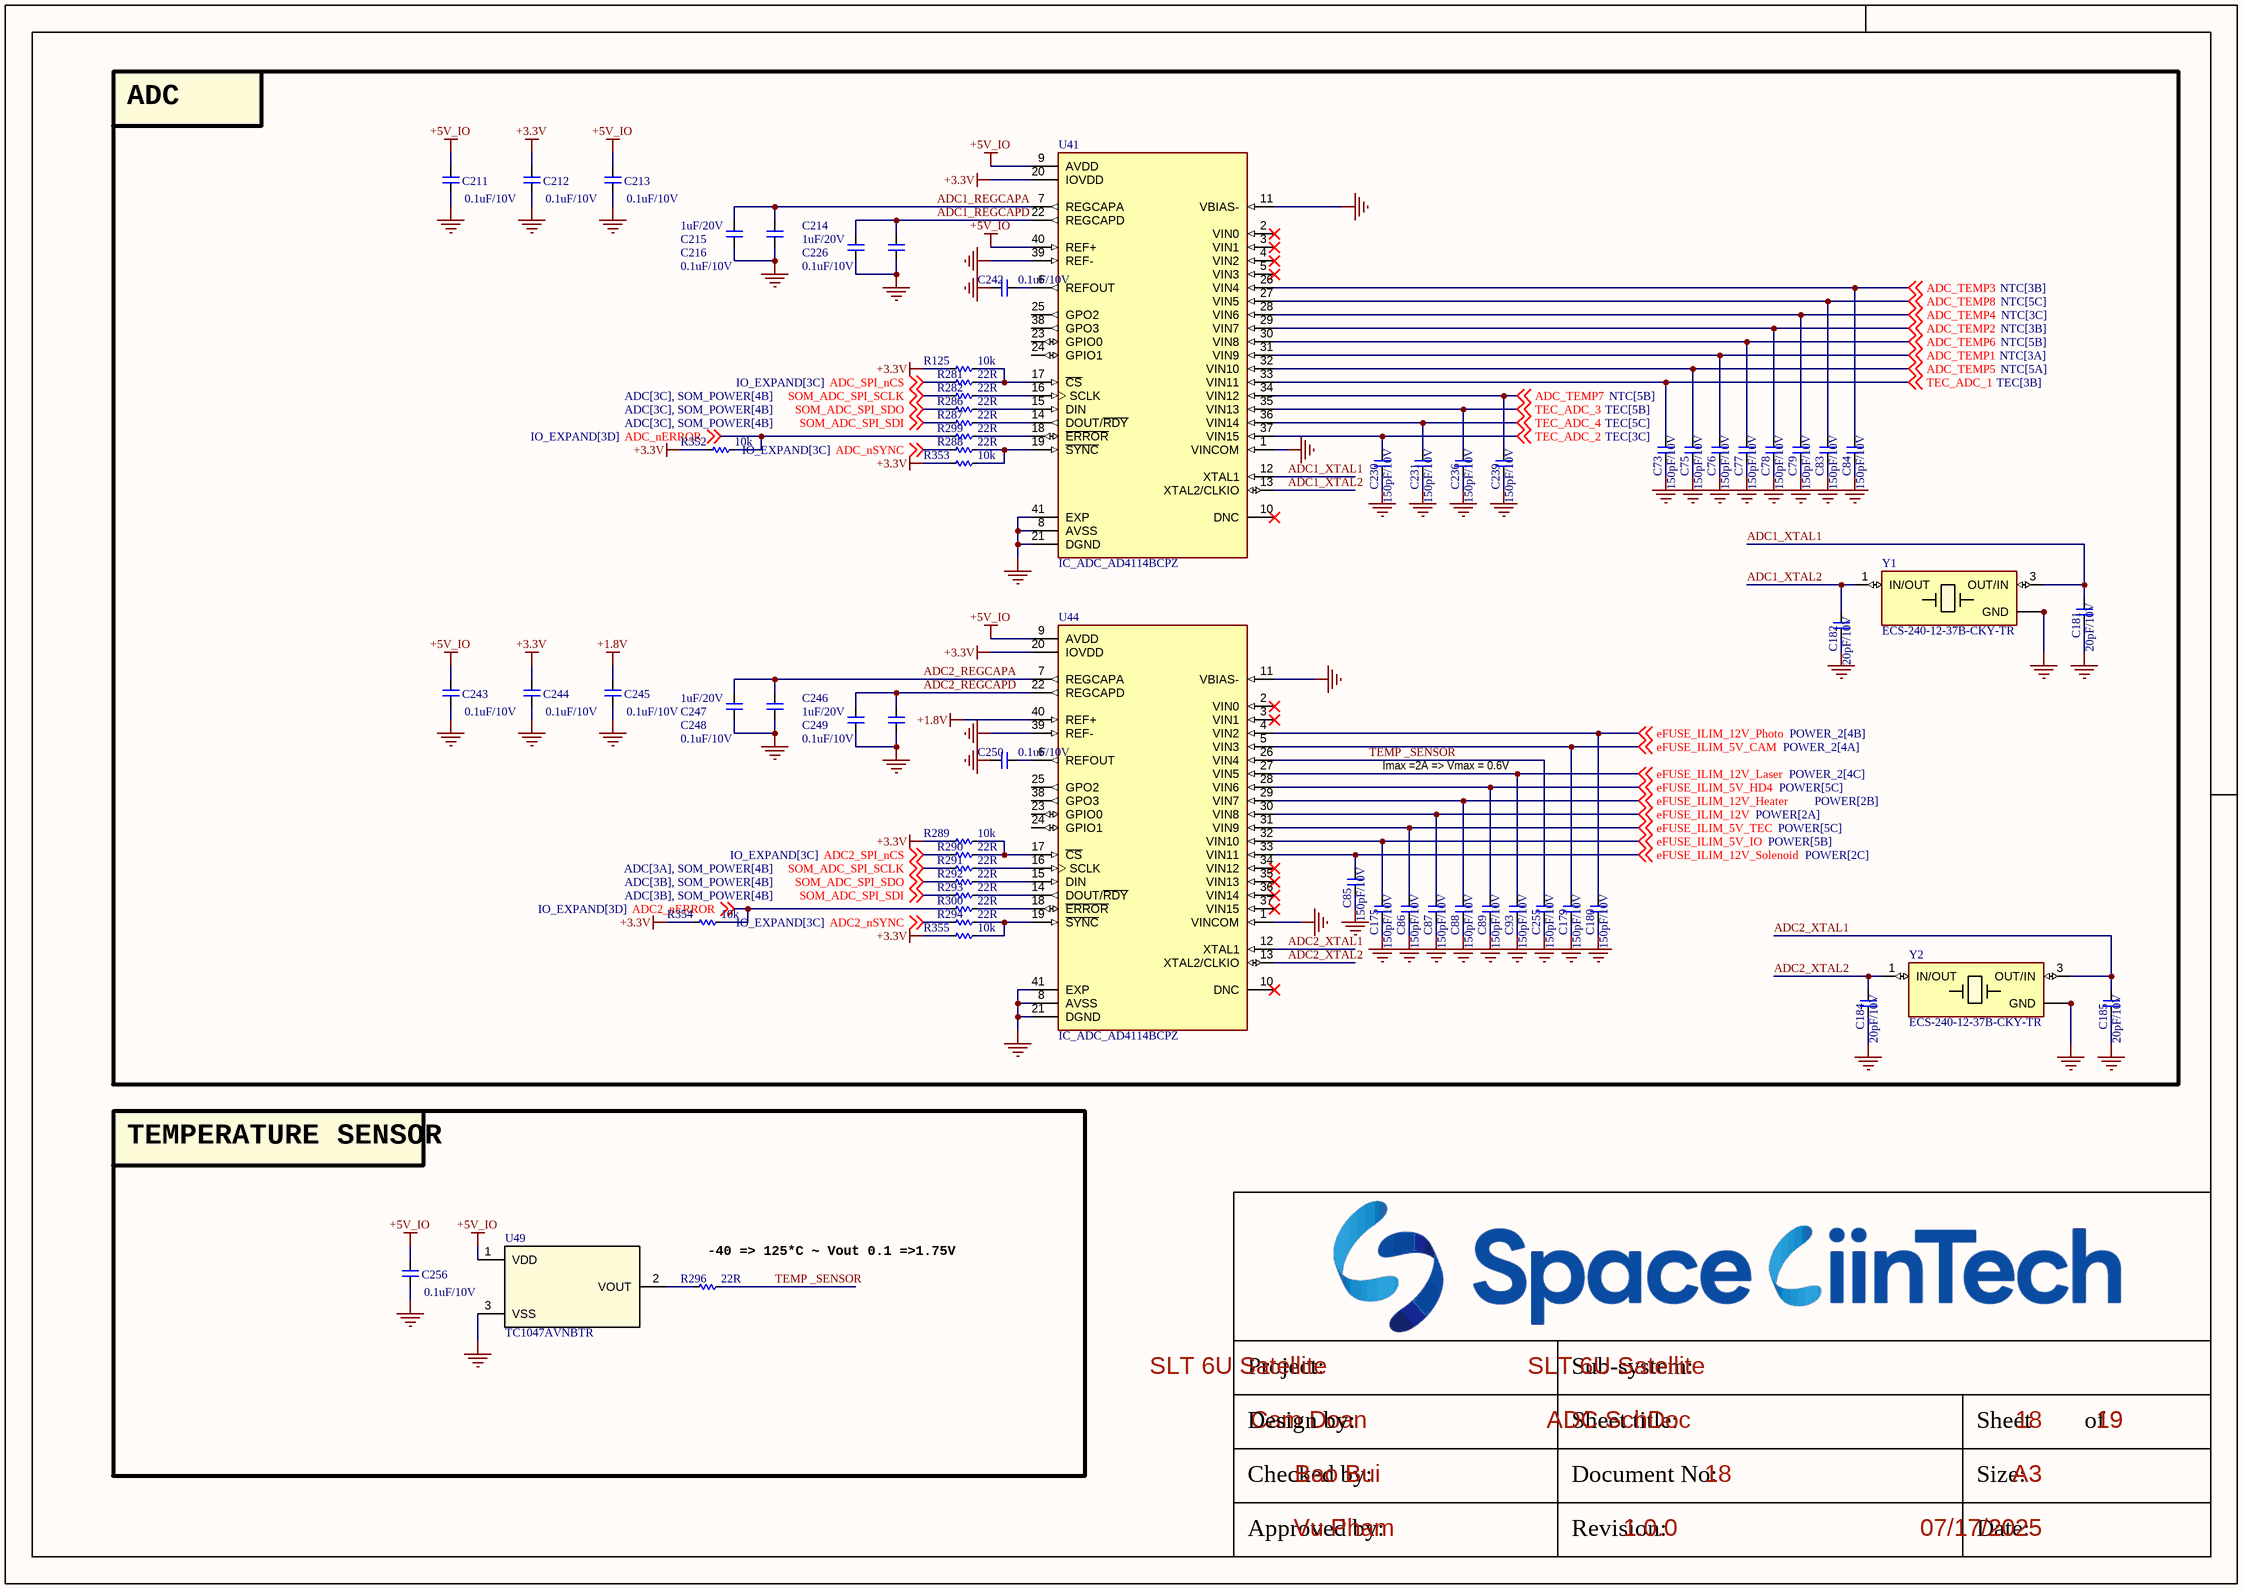
[diagram p24: ADC.SchDoc]

### Parts
C73  150pF/10V  [CAP_C_1005X60]
C75  150pF/10V  [CAP_C_1005X60]
C76  150pF/10V  [CAP_C_1005X60]
C77  150pF/10V  [CAP_C_1005X60]
C78  150pF/10V  [CAP_C_1005X60]
C79  150pF/10V  [CAP_C_1005X60]
C83  150pF/10V  [CAP_C_1005X60]
C84  150pF/10V  [CAP_C_1005X60]
C85  150pF/10V  [CAP_C_1005X60]
C86  150pF/10V  [CAP_C_1005X60]
C87  150pF/10V  [CAP_C_1005X60]
C88  150pF/10V  [CAP_C_1005X60]
C89  150pF/10V  [CAP_C_1005X60]
C93  150pF/10V  [CAP_C_1005X60]
C175  150pF/10V  [CAP_C_1005X60]
C179  150pF/10V  [CAP_C_1005X60]
C180  150pF/10V  [CAP_C_1005X60]
C181  20pF/10V  [CAP_C_1005X60]
C182  20pF/10V  [CAP_C_1005X60]
C184  20pF/10V  [CAP_C_1005X60]
C185  20pF/10V  [CAP_C_1005X60]
C211  0.1uF/10V  [CAP_C_1005X60]
C212  0.1uF/10V  [CAP_C_1005X60]
C213  0.1uF/10V  [CAP_C_1005X60]
C214  1uF/20V  [CAP_C_1005X60]
C215  1uF/20V  [CAP_C_1005X60]
C216  0.1uF/10V  [CAP_C_1005X60]
C226  0.1uF/10V  [CAP_C_1005X60]
C230  150pF/10V  [CAP_C_1005X60]
C231  150pF/10V  [CAP_C_1005X60]
C236  150pF/10V  [CAP_C_1005X60]
C239  150pF/10V  [CAP_C_1005X60]
C242  0.1uF/10V  [CAP_C_1005X60]
C243  0.1uF/10V  [CAP_C_1005X60]
C244  0.1uF/10V  [CAP_C_1005X60]
C245  0.1uF/10V  [CAP_C_1005X60]
C246  1uF/20V  [CAP_C_1005X60]
C247  1uF/20V  [CAP_C_1005X60]
C248  0.1uF/10V  [CAP_C_1005X60]
C249  0.1uF/10V  [CAP_C_1005X60]
C250  0.1uF/10V  [CAP_C_1005X60]
C255  150pF/10V  [CAP_C_1005X60]
C256  0.1uF/10V  [CAP_C_1005X60]
R125  10k  [RES_C_1005X40]
R281  22R  [RES_C_1005X40]
R282  22R  [RES_C_1005X40]
R286  22R  [RES_C_1005X40]
R287  22R  [RES_C_1005X40]
R288  22R  [RES_C_1005X40]
R289  10k  [RES_C_1005X40]
R290  22R  [RES_C_1005X40]
R291  22R  [RES_C_1005X40]
R292  22R  [RES_C_1005X40]
R293  22R  [RES_C_1005X40]
R294  22R  [RES_C_1005X40]
R296  22R  [RES_C_1005X40]
R299  22R  [RES_C_1005X40]
R300  22R  [RES_C_1005X40]
R352  10k  [RES_C_1005X40]
R353  10k  [RES_C_1005X40]
R354  10k  [RES_C_1005X40]
R355  10k  [RES_C_1005X40]
U41  IC_ADC_AD4114BCPZ  [QFN50P600X600X100-41N]
U44  IC_ADC_AD4114BCPZ  [QFN50P600X600X100-41N]
U49  TC1047AVNBTR  [SOT95P240X120-3N]
Y1  ECS-240-12-37B-CKY-TR  [XTAL_ECS-240-12-37B-CKY-TR]
Y2  ECS-240-12-37B-CKY-TR  [XTAL_ECS-240-12-37B-CKY-TR]

### Blocks framed on the sheet
ADC: C73 C75-C79 C83-C89 C93 C175 C179-C182 C184 C185 C211-C216 C226 C230 C231 C236 C239 C242-C250 C255 R125 R281 R282 R286-R294 R299 R300 R352-R355 U41 U44 Y1 Y2
TEMPERATURE SENSOR: C256 R296 U49

### Nets
+1.8V: C245.2 U44.40(REF+)
+3.3V: C212.2 C244.2 R125.2 R289.2 R352.2 R353.2 R354.2 R355.2 U41.20(IOVDD) U44.20(IOVDD)
+5V_IO: C211.2 C213.2 C243.2 C256.2 U41.9(AVDD) U41.40(REF+) U44.9(AVDD) U49.1(VDD)  [project net NTC1+]
GND: C73.1 C75.1 C76.1 C77.1 C78.1 C79.1 C83.1 C84.1 C85.1 C86.1 C87.1 C88.1 C89.1 C93.1 C175.1 C179.1 C180.1 C181.1 C182.1 C184.1 C185.1 C211.1 C212.1 C213.1 C214.1 C215.1 C216.1 C226.1 C230.1 C231.1 C236.1 C239.1 C242.1 C243.1 C244.1 C245.1 C246.1 C247.1 C248.1 C249.1 C250.1 C255.1 C256.1 U41.1(VINCOM) U41.8(AVSS) U41.11(VBIAS-) U41.21(DGND) U41.39(REF-) U41.41(EXP) U44.1(VINCOM) U44.8(AVSS) U44.11(VBIAS-) U44.21(DGND) U44.39(REF-) U44.41(EXP) U49.3(VSS) Y1.2(GND) Y1.4(GND) Y2.2(GND) Y2.4(GND)
ADC1_REGCAPA: C215.2 C216.2 U41.7(REGCAPA)
ADC1_REGCAPD: C214.2 C226.2 U41.22(REGCAPD)
ADC1_XTAL1: C181.2 U41.12(XTAL1) Y1.3(OUT/IN)
ADC1_XTAL2: C182.2 U41.13(XTAL2/CLKIO) Y1.1(IN/OUT)
ADC2_nERROR: R300.1 R354.1 ; off-sheet ADC2_nERROR
ADC2_nSYNC: R294.1 ; off-sheet ADC2_nSYNC
ADC2_REGCAPA: C247.2 C248.2 U44.7(REGCAPA)
ADC2_REGCAPD: C246.2 C249.2 U44.22(REGCAPD)
ADC2_SPI_nCS: R290.1 ; off-sheet ADC2_SPI_nCS
ADC2_XTAL1: C185.2 U44.12(XTAL1) Y2.3(OUT/IN)
ADC2_XTAL2: C184.2 U44.13(XTAL2/CLKIO) Y2.1(IN/OUT)
ADC_nERROR: R299.1 R352.1 ; off-sheet ADC_nERROR
ADC_nSYNC: R288.1 ; off-sheet ADC_nSYNC
ADC_SPI_nCS: R281.1 ; off-sheet ADC_SPI_nCS
ADC_TEMP1: C76.2 U41.31(VIN9) ; off-sheet ADC_TEMP1
ADC_TEMP2: C78.2 U41.29(VIN7) ; off-sheet ADC_TEMP2
ADC_TEMP3: C84.2 U41.26(VIN4) ; off-sheet ADC_TEMP3
ADC_TEMP4: C79.2 U41.28(VIN6) ; off-sheet ADC_TEMP4
ADC_TEMP5: C75.2 U41.32(VIN10) ; off-sheet ADC_TEMP5
ADC_TEMP6: C77.2 U41.30(VIN8) ; off-sheet ADC_TEMP6
ADC_TEMP7: C239.2 U41.34(VIN12) ; off-sheet ADC_TEMP7
ADC_TEMP8: C83.2 U41.27(VIN5) ; off-sheet ADC_TEMP8
eFUSE_ILIM_5V_CAM: C179.2 U44.5(VIN3) ; off-sheet eFUSE_ILIM_5V_CAM
eFUSE_ILIM_5V_HD4: C89.2 U44.28(VIN6) ; off-sheet eFUSE_ILIM_5V_HD4
eFUSE_ILIM_5V_IO: C175.2 U44.32(VIN10) ; off-sheet eFUSE_ILIM_5V_IO
eFUSE_ILIM_5V_TEC: C86.2 U44.31(VIN9) ; off-sheet eFUSE_ILIM_5V_TEC
eFUSE_ILIM_12V: C87.2 U44.30(VIN8) ; off-sheet eFUSE_ILIM_12V
eFUSE_ILIM_12V_Heater: C88.2 U44.29(VIN7) ; off-sheet eFUSE_ILIM_12V_Heater
eFUSE_ILIM_12V_Laser: C93.2 U44.27(VIN5) ; off-sheet eFUSE_ILIM_12V_Laser
eFUSE_ILIM_12V_Photo: C180.2 U44.4(VIN2) ; off-sheet eFUSE_ILIM_12V_Photo
eFUSE_ILIM_12V_Solenoid: C85.2 U44.33(VIN11) ; off-sheet eFUSE_ILIM_12V_Solenoid
SOM_ADC_SPI_SCLK: R282.1 R291.1 ; off-sheet SOM_ADC_SPI_SCLK  [project net SOM_TEC_SPI6_SCK]
SOM_ADC_SPI_SDI: R287.1 R293.1 ; off-sheet SOM_ADC_SPI_SDI  [project net SOM_TEC_SPI6_MOSI]
SOM_ADC_SPI_SDO: R286.1 R292.1 ; off-sheet SOM_ADC_SPI_SDO  [project net SOM_TEC_SPI6_MISO]
TEC_ADC_1: C73.2 U41.33(VIN11) ; off-sheet TEC_ADC_1
TEC_ADC_2: C230.2 U41.37(VIN15) ; off-sheet TEC_ADC_2
TEC_ADC_3: C236.2 U41.35(VIN13) ; off-sheet TEC_ADC_3
TEC_ADC_4: C231.2 U41.36(VIN14) ; off-sheet TEC_ADC_4
TEMP _SENSOR: C255.2 R296.2 U44.26(VIN4)
NetC242_2: C242.2 U41.6(REFOUT)
NetC250_2: C250.2 U44.6(REFOUT)
NetR125_1: R125.1 R281.2 U41.17(~{CS})
NetR282_2: R282.2 U41.16(SCLK)
NetR286_2: R286.2 U41.15(DIN)
NetR287_2: R287.2 U41.14(DOUT/~{RDY})
NetR288_2: R288.2 R353.1 U41.19(~{SYNC})
NetR289_1: R289.1 R290.2 U44.17(~{CS})
NetR291_2: R291.2 U44.16(SCLK)
NetR292_2: R292.2 U44.15(DIN)
NetR293_2: R293.2 U44.14(DOUT/~{RDY})
NetR294_2: R294.2 R355.1 U44.19(~{SYNC})
NetR296_1: R296.1 U49.2(VOUT)
NetR299_2: R299.2 U41.18(~{ERROR})
NetR300_2: R300.2 U44.18(~{ERROR})

Not connected (* = marked no-connect by the designer): U41 2(VIN0)* 3(VIN1)* 4(VIN2)* 5(VIN3)* 10(DNC)* 23(GPIO0) 24(GPIO1) 25(GPO2) 38(GPO3); U44 2(VIN0)* 3(VIN1)* 10(DNC)* 23(GPIO0) 24(GPIO1) 25(GPO2) 34(VIN12)* 35(VIN13)* 36(VIN14)* 37(VIN15)* 38(GPO3)

### Notes on the sheet
- Imax =2A => Vmax = 0.6V
- (near R296) -40 => 125*C ~ Vout 0.1 =>1.75V
- Project:
- Sub-system:
- Design by:
- Sheet title:
- Sheet
- of
- Checked by:
- Approved by:
- Revision:
- Document No:
- Size:
- Date:
- A3

### Library data of the parts
C73 C75-C79 C83-C89 C93 C175 C179-C182 C184 C185 C211-C216 C226 C230 C231 C236 C239 C242-C250 C255 C256 = _CAP_C_2: CAP CHIP
R125 R281 R282 R286-R294 R296 R299 R300 R352-R355 = _RES_B_2: RES
U41 U44 = IC_ADC_AD4114BCPZ: Single Supply, Multichannel, 31.25 kSPS, 24-Bit, Sigma-Delta ADC with Â±10 V Inputs; MF: Analog Devices; Value: *; SnapEDA_Link: https://www.snapeda.com/parts/AD4114BCPZ/Analog+Devices/view-part/?ref=snap; MP: AD4114BCPZ; Purchase-URL: https://pricing.snapeda.com/search/part/AD4114BCPZ/?ref=eda; Check_prices: https://www.snapeda.com/parts/AD4114BCPZ/Analog+Devices/view-part/?ref=eda; Availability: In Stock; Price: None; Package: VFQFN-40 Analog Devices
U49 = IC_SENSOR_TC1047AVNBTR: Temperature Sensor Analog, Local -40°C ~ 125°C 10mV/°C SOT-23-3
Y1 Y2 = ECS-240-12-37B-CKY-TR: Package: None; Price: None; Value: *; MP: ECS-240-12-37B-CKY-TR; Availability: Unavailable

## Sheet I2C_Sensor.SchDoc
size 420 x 297 mm; SheetNumber: 19; SheetTotal: 19
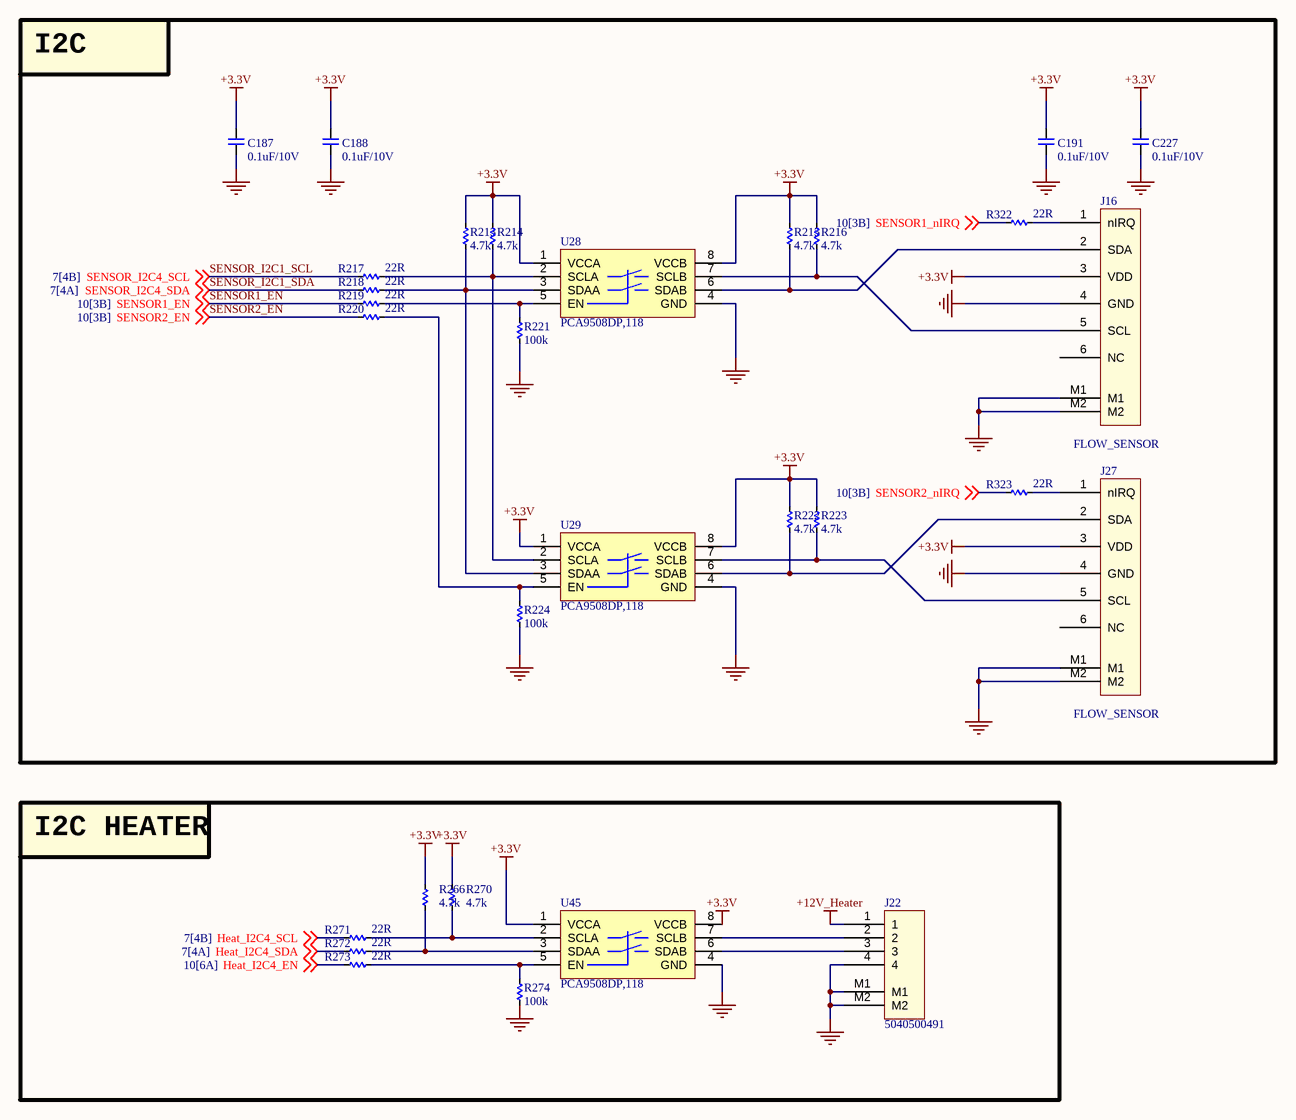
[diagram p25: I2C_Sensor.SchDoc]

### Parts
C187  0.1uF/10V  [CAP_C_1005X60]
C188  0.1uF/10V  [CAP_C_1005X60]
C191  0.1uF/10V  [CAP_C_1005X60]
C227  0.1uF/10V  [CAP_C_1005X60]
J16  FLOW_SENSOR  [MOLEX_0533980671]
J22  5040500491  [MOLEX_5040500491]
J27  FLOW_SENSOR  [MOLEX_0533980671]
R213  4.7k  [RES_C_1005X40]
R214  4.7k  [RES_C_1005X40]
R215  4.7k  [RES_C_1005X40]
R216  4.7k  [RES_C_1005X40]
R217  22R  [RES_C_1005X40]
R218  22R  [RES_C_1005X40]
R219  22R  [RES_C_1005X40]
R220  22R  [RES_C_1005X40]
R221  100k  [RES_C_1005X40]
R222  4.7k  [RES_C_1005X40]
R223  4.7k  [RES_C_1005X40]
R224  100k  [RES_C_1005X40]
R266  4.7k  [RES_C_1005X40]
R270  4.7k  [RES_C_1005X40]
R271  22R  [RES_C_1005X40]
R272  22R  [RES_C_1005X40]
R273  22R  [RES_C_1005X40]
R274  100k  [RES_C_1005X40]
R322  22R  [RES_C_1005X40]
R323  22R  [RES_C_1005X40]
U28  PCA9508DP,118  [TSOP8]
U29  PCA9508DP,118  [TSOP8]
U45  PCA9508DP,118  [TSOP8]

### Blocks framed on the sheet
I2C: C187 C188 C191 C227 J16 J27 R213-R224 R322 R323 U28 U29
I2C HEATER: J22 R266 R270-R274 U45

### Nets
+3.3V: C187.2 C188.2 C191.2 C227.2 J16.3(VDD) J27.3(VDD) R213.1 R214.1 R215.1 R216.1 R222.1 R223.1 R266.1 R270.1 U28.1(VCCA) U28.8(VCCB) U29.1(VCCA) U29.8(VCCB) U45.1(VCCA) U45.8(VCCB)
+12V_Heater: J22.1  [project net HEATER_A_1]
GND: C187.1 C188.1 C191.1 C227.1 J16.4(GND) J16.M1 J16.M2 J22.4 J22.M1 J22.M2 J27.4(GND) J27.M1 J27.M2 R221.2 R224.2 R274.2 U28.4(GND) U29.4(GND) U45.4(GND)
Heat_I2C4_EN: R273.2 ; off-sheet Heat_I2C4_EN
Heat_I2C4_SCL: R217.2 R271.2 ; off-sheet SENSOR_I2C4_SCL, off-sheet Heat_I2C4_SCL  [also labelled SENSOR_I2C1_SCL, SENSOR_I2C4_SCL]  [project net I2C4_SCL]
Heat_I2C4_SDA: R218.2 R272.2 ; off-sheet SENSOR_I2C4_SDA, off-sheet Heat_I2C4_SDA  [also labelled SENSOR_I2C1_SDA, SENSOR_I2C4_SDA]  [project net I2C4_SDA]
SENSOR1_EN: R219.2 ; off-sheet SENSOR1_EN
SENSOR1_nIRQ: R322.2 ; off-sheet SENSOR1_nIRQ
SENSOR2_EN: R220.2 ; off-sheet SENSOR2_EN
SENSOR2_nIRQ: R323.2 ; off-sheet SENSOR2_nIRQ
NetJ16_1: J16.1(nIRQ) R322.1
NetJ16_2: J16.2(SDA) R215.2 U28.6(SDAB)
NetJ16_5: J16.5(SCL) R216.2 U28.7(SCLB)
NetJ22_2: J22.2 U45.7(SCLB)
NetJ22_3: J22.3 U45.6(SDAB)
NetJ27_1: J27.1(nIRQ) R323.1
NetJ27_2: J27.2(SDA) R222.2 U29.6(SDAB)
NetJ27_5: J27.5(SCL) R223.2 U29.7(SCLB)
NetR213_2: R213.2 R218.1 U28.3(SDAA) U29.3(SDAA)
NetR214_2: R214.2 R217.1 U28.2(SCLA) U29.2(SCLA)
NetR219_1: R219.1 R221.1 U28.5(EN)
NetR220_1: R220.1 R224.1 U29.5(EN)
NetR266_2: R266.2 R272.1 U45.3(SDAA)
NetR270_2: R270.2 R271.1 U45.2(SCLA)
NetR273_1: R273.1 R274.1 U45.5(EN)

Not connected (* = marked no-connect by the designer): J16 6(NC); J27 6(NC)

### Notes on the sheet
- Project:
- Sub-system:
- Design by:
- Sheet title:
- Sheet
- of
- Checked by:
- Approved by:
- Revision:
- Document No:
- Size:
- Date:
- A3

### Library data of the parts
C187 C188 C191 C227 = _CAP_C_2: CAP CHIP
J22 = Header 4x1_2M
R213-R224 R266 R270-R274 R322 R323 = _RES_B_2: RES